# Altium project multi_power_amp_revision.PrjPcb
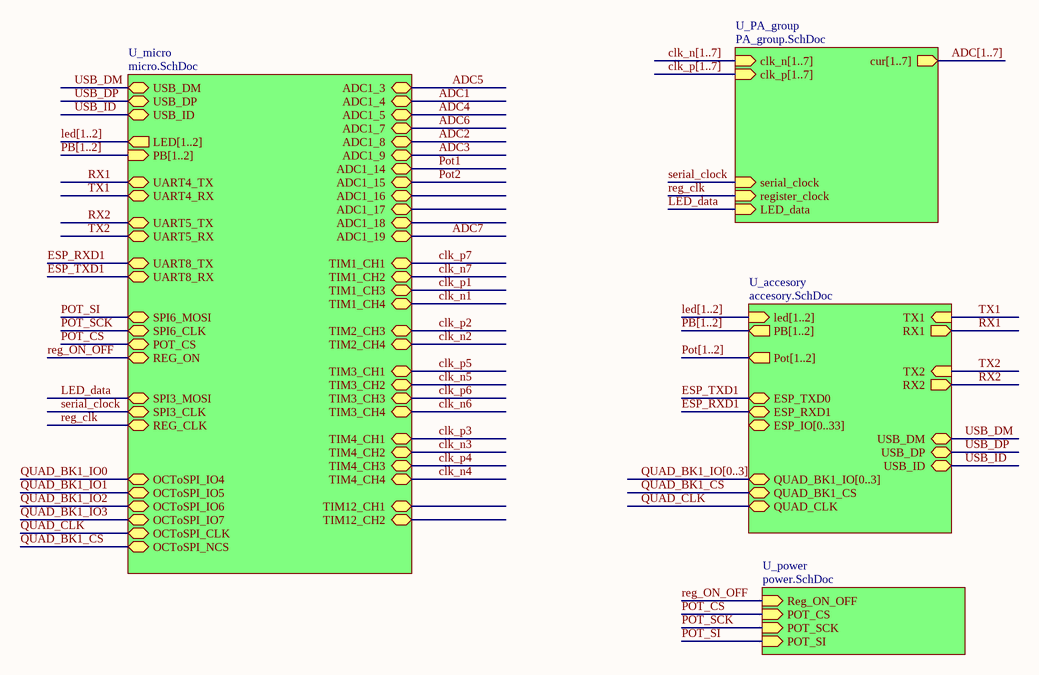
[diagram p0: top.SchDoc]
8 sheets, 322 parts. Net scope: hierarchical (ports join the sheet entries above them; power ports are global).
Board file: PowerAMP_revision.PcbDoc
Sheets:
  top.SchDoc
    U_micro = micro.SchDoc
    U_accesory = accesory.SchDoc
    U_PA_group = PA_group.SchDoc
      PA1 = PA_classD.SchDoc
        L = led_PA.SchDoc
      PA2 = PA_classD.SchDoc
        L = led_PA.SchDoc
      PA3 = PA_classD.SchDoc
        L = led_PA.SchDoc
      PA4 = PA_classD.SchDoc
        L = led_PA.SchDoc
      PA5 = PA_classD.SchDoc
        L = led_PA.SchDoc
      PA6 = PA_classD.SchDoc
        L = led_PA.SchDoc
      PA7 = PA_classD.SchDoc
        L = led_PA.SchDoc
      Rect = rectifiers.SchDoc
    U_power = power.SchDoc

## Sheet top.SchDoc
size A4

### Sub-sheets
U_accesory = accesory.SchDoc: led[1..2] (in), PB[1..2] (out), Pot[1..2] (out), RX1 (out), RX2 (out), TX1 (in), TX2 (in), USB_DM (bidir), USB_DP (bidir), USB_ID (bidir), ESP_TXD0 (bidir), ESP_RXD1 (bidir), ESP_IO[0..33] (bidir), QUAD_BK1_IO[0..3] (bidir), QUAD_BK1_CS (bidir), QUAD_CLK (bidir)
U_micro = micro.SchDoc: USB_DM (bidir), USB_DP (bidir), LED[1..2] (out), PB[1..2] (in), UART5_RX (bidir), ADC1_19 (bidir), REG_CLK (bidir), SPI6_MOSI (bidir), UART8_TX (bidir), SPI3_MOSI (bidir), ADC1_4 (bidir), UART4_TX (bidir), ADC1_7 (bidir), UART5_TX (bidir), ADC1_3 (bidir), ADC1_8 (bidir), ADC1_9 (bidir), UART8_RX (bidir), ADC1_5 (bidir), REG_ON (bidir), SPI3_CLK (bidir), SPI6_CLK (bidir), UART4_RX (bidir), ADC1_16 (bidir), TIM1_CH3 (bidir), TIM1_CH4 (bidir), TIM3_CH2 (bidir), TIM4_CH1 (bidir), TIM2_CH4 (bidir), ADC1_18 (bidir), TIM1_CH2 (bidir), ADC1_14 (bidir), TIM3_CH4 (bidir), TIM3_CH3 (bidir), ADC1_17 (bidir), TIM3_CH1 (bidir), TIM4_CH3 (bidir), USB_ID (bidir), TIM4_CH2 (bidir), ADC1_15 (bidir), TIM2_CH3 (bidir), TIM12_CH2 (bidir), TIM1_CH1 (bidir), TIM12_CH1 (bidir), TIM4_CH4 (bidir), POT_CS (bidir), OCToSPI_IO4 (bidir), OCToSPI_IO5 (bidir), OCToSPI_CLK (bidir), OCToSPI_IO7 (bidir), OCToSPI_NCS (bidir), OCToSPI_IO6 (bidir)
U_PA_group = PA_group.SchDoc: serial_clock (in), register_clock (in), LED_data (in), clk_n[1..7] (in), clk_p[1..7] (in), cur[1..7] (out)
U_power = power.SchDoc: Reg_ON_OFF (in), POT_CS (in), POT_SCK (in), POT_SI (in)

### Nets
ESP_RXD1: sheet U_micro/UART8_TX, sheet U_accesory/ESP_RXD1  [project net ESP_RXD0]
ESP_TXD1: sheet U_micro/UART8_RX, sheet U_accesory/ESP_TXD0  [project net ESP_TXD0]
LED_data: sheet U_micro/SPI3_MOSI, sheet U_PA_group/LED_data
POT_CS: sheet U_micro/POT_CS, sheet U_power/POT_CS
POT_SCK: sheet U_micro/SPI6_CLK, sheet U_power/POT_SCK
POT_SI: sheet U_micro/SPI6_MOSI, sheet U_power/POT_SI
QUAD_BK1_CS: sheet U_micro/OCToSPI_NCS, sheet U_accesory/QUAD_BK1_CS
QUAD_CLK: sheet U_micro/OCToSPI_CLK, sheet U_accesory/QUAD_CLK
reg_clk: sheet U_micro/REG_CLK, sheet U_PA_group/register_clock
reg_ON_OFF: sheet U_micro/REG_ON, sheet U_power/Reg_ON_OFF
RX1: sheet U_micro/UART4_TX, sheet U_accesory/RX1
RX2: sheet U_micro/UART5_TX, sheet U_accesory/RX2
serial_clock: sheet U_micro/SPI3_CLK, sheet U_PA_group/serial_clock
TX1: sheet U_micro/UART4_RX, sheet U_accesory/TX1
TX2: sheet U_micro/UART5_RX, sheet U_accesory/TX2
USB_DM: sheet U_micro/USB_DM, sheet U_accesory/USB_DM
USB_DP: sheet U_micro/USB_DP, sheet U_accesory/USB_DP
USB_ID: sheet U_micro/USB_ID, sheet U_accesory/USB_ID

### Buses and harness runs
bus ADC[1..7] = sheet U_PA_group/cur[1..7]
bus clk_n[1..7] = sheet U_PA_group/clk_n[1..7]
bus clk_p[1..7] = sheet U_PA_group/clk_p[1..7]
bus led[1..2] = sheet U_accesory/led[1..2]
bus led[1..2] = sheet U_micro/LED[1..2]
bus PB[1..2] = sheet U_accesory/PB[1..2]
bus PB[1..2] = sheet U_micro/PB[1..2]
bus Pot[1..2] = sheet U_accesory/Pot[1..2]
bus QUAD_BK1_IO[0..3] = sheet U_accesory/QUAD_BK1_IO[0..3]

## Sheet micro.SchDoc
size A4
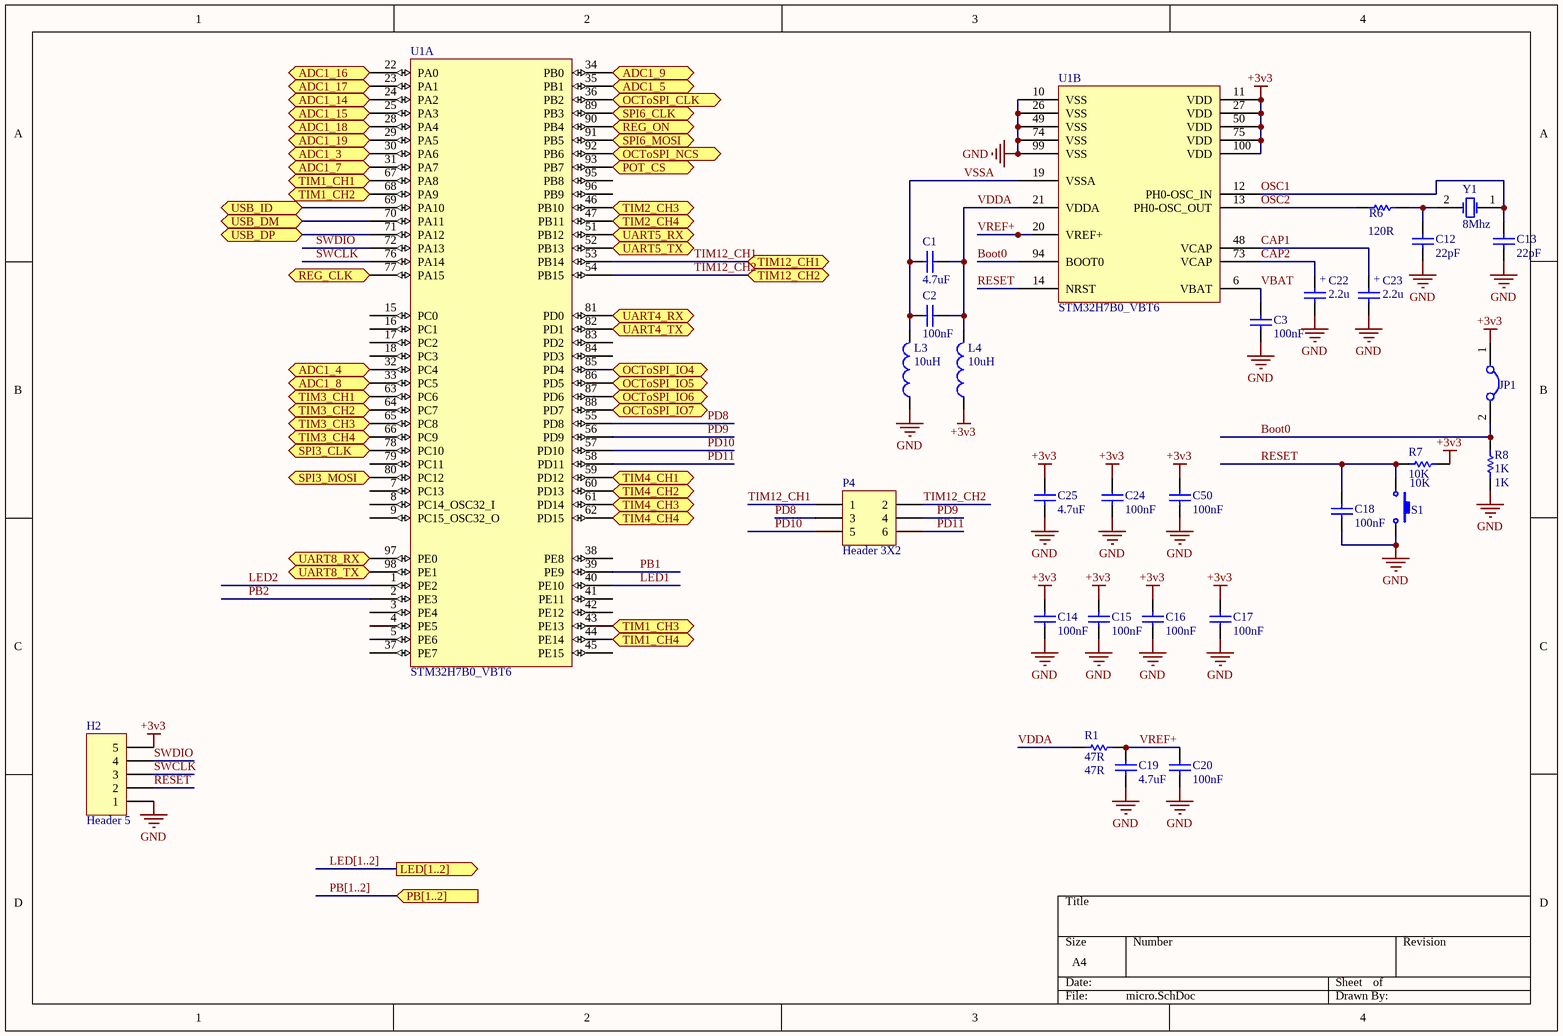
[diagram p1: micro.SchDoc]

### Parts
C1  4.7uF  [SMD_CAP_0805]
C2  100nF  [SMD_CAP_0805]
C3  100nF  [SMD_CAP_0805]
C12  22pF  [SMD_CAP_0805]
C13  22pF  [SMD_CAP_0805]
C14  100nF  [SMD_CAP_0805]
C15  100nF  [SMD_CAP_0805]
C16  100nF  [SMD_CAP_0805]
C17  100nF  [SMD_CAP_0805]
C18  100nF  [SMD_CAP_0805]
C19  4.7uF  [SMD_CAP_0805]
C20  100nF  [SMD_CAP_0805]
C22  value 2.2u  [SMD_CAP_0805]  (hidden comment: tantal size a)
C23  value 2.2u  [SMD_CAP_0805]  (hidden comment: tantal size a)
C24  100nF  [SMD_CAP_0805]
C25  4.7uF  [SMD_CAP_0805]
C50  100nF  [SMD_CAP_0805]
H2  Header 5  [HDR1X5]
JP1  Jumper  [Jumper Small - 2.54 - GRAY]  (value not drawn)
L3  value 10uH  [IND1206]  (hidden comment: inductor 10uH)
L4  value 10uH  [IND1206]  (hidden comment: inductor 10uH)
P4  Header 3X2  [HDR2X3]
R1  47R  [RES 0805 (2012X06L)]
R6  120R  [RES 0805 (2012X06L)]
R7  10K  [RES 0805 (2012X06L)]
R8  1K  [RES 0805 (2012X06L)]
S1  Switch PB  [Switch - Push to On]  (value not drawn)
U1  STM32H7B0_VBT6  [LQFP100_N]  (parts A,B of 2)
Y1  8Mhz  [CRYSTAL Small]

### Ports
ADC1_3 (bidir), ADC1_4 (bidir), ADC1_5 (bidir), ADC1_7 (bidir), ADC1_8 (bidir), ADC1_9 (bidir), ADC1_14 (bidir), ADC1_15 (bidir), ADC1_16 (bidir), ADC1_17 (bidir), ADC1_18 (bidir), ADC1_19 (bidir), LED[1..2] (out), OCToSPI_CLK (bidir), OCToSPI_IO4 (bidir), OCToSPI_IO5 (bidir), OCToSPI_IO6 (bidir), OCToSPI_IO7 (bidir), OCToSPI_NCS (bidir), PB[1..2] (in), POT_CS (bidir), REG_CLK (bidir), REG_ON (bidir), SPI3_CLK (bidir), SPI3_MOSI (bidir), SPI6_CLK (bidir), SPI6_MOSI (bidir), TIM1_CH1 (bidir), TIM1_CH2 (bidir), TIM1_CH3 (bidir), TIM1_CH4 (bidir), TIM2_CH3 (bidir), TIM2_CH4 (bidir), TIM3_CH1 (bidir), TIM3_CH2 (bidir), TIM3_CH3 (bidir), TIM3_CH4 (bidir), TIM4_CH1 (bidir), TIM4_CH2 (bidir), TIM4_CH3 (bidir), TIM4_CH4 (bidir), TIM12_CH1 (bidir), TIM12_CH2 (bidir), UART4_RX (bidir), UART4_TX (bidir), UART5_RX (bidir), UART5_TX (bidir), UART8_RX (bidir), UART8_TX (bidir), USB_DM (bidir), USB_DP (bidir), USB_ID (bidir)

### Nets
+3v3: C14.2 C15.2 C16.2 C17.2 C24.2 C25.1 C50.1 H2.5 JP1.1 L4.1 R7.1 U1.11(VDD) U1.27(VDD) U1.50(VDD) U1.75(VDD) U1.100(VDD)
GND: C3.1 C12.1 C13.1 C14.1 C15.1 C16.1 C17.1 C18.1 C19.2 C20.1 C22.- C23.- C24.1 C25.2 C50.2 H2.1 L3.1 R8.1 S1.2 U1.10(VSS) U1.26(VSS) U1.49(VSS) U1.74(VSS) U1.99(VSS)
ADC1: U1.32(PC4) ; port ADC1_4
ADC2: U1.33(PC5) ; port ADC1_8
ADC3: U1.34(PB0) ; port ADC1_9
ADC4: U1.35(PB1) ; port ADC1_5
ADC5: U1.30(PA6) ; port ADC1_3
ADC6: U1.31(PA7) ; port ADC1_7
ADC7: U1.29(PA5) ; port ADC1_19
Boot0: JP1.2 R8.2 U1.94(BOOT0)
CAP1: C23.+ U1.48(VCAP)
CAP2: C22.+ U1.73(VCAP)
clk_n1: U1.44(PE14) ; port TIM1_CH4
clk_n2: U1.47(PB11) ; port TIM2_CH4
clk_n3: U1.60(PD13) ; port TIM4_CH2
clk_n4: U1.62(PD15) ; port TIM4_CH4
clk_n5: U1.64(PC7) ; port TIM3_CH2
clk_n6: U1.66(PC9) ; port TIM3_CH4
clk_n7: U1.68(PA9) ; port TIM1_CH2
clk_p1: U1.43(PE13) ; port TIM1_CH3
clk_p2: U1.46(PB10) ; port TIM2_CH3
clk_p3: U1.59(PD12) ; port TIM4_CH1
clk_p4: U1.61(PD14) ; port TIM4_CH3
clk_p5: U1.63(PC6) ; port TIM3_CH1
clk_p6: U1.65(PC8) ; port TIM3_CH3
clk_p7: U1.67(PA8) ; port TIM1_CH1
ESP_RXD0: U1.98(PE1) ; port UART8_TX
ESP_TXD0: U1.97(PE0) ; port UART8_RX
LED1: U1.40(PE10)
LED2: U1.1(PE2)
LED_data: U1.80(PC12) ; port SPI3_MOSI
OSC1: C13.2 U1.12(PH0-OSC_IN) Y1.1(OSC1)
OSC2: R6.1 U1.13(PH0-OSC_OUT)
PB1: U1.39(PE9)
PB2: U1.2(PE3)
PD8: P4.3 U1.55(PD8)
PD9: P4.4 U1.56(PD9)
PD10: P4.5 U1.57(PD10)
PD11: P4.6 U1.58(PD11)
Pot1: U1.24(PA2) ; port ADC1_14
Pot2: U1.25(PA3) ; port ADC1_15
POT_CS: U1.93(PB7) ; port POT_CS
POT_SCK: U1.89(PB3) ; port SPI6_CLK
POT_SI: U1.91(PB5) ; port SPI6_MOSI
QUAD_BK1_CS: U1.92(PB6) ; port OCToSPI_NCS
QUAD_BK1_IO0: U1.85(PD4) ; port OCToSPI_IO4
QUAD_BK1_IO1: U1.86(PD5) ; port OCToSPI_IO5
QUAD_BK1_IO2: U1.87(PD6) ; port OCToSPI_IO6
QUAD_BK1_IO3: U1.88(PD7) ; port OCToSPI_IO7
QUAD_CLK: U1.36(PB2) ; port OCToSPI_CLK
reg_clk: U1.77(PA15) ; port REG_CLK
reg_ON_OFF: U1.90(PB4) ; port REG_ON
RESET: C18.2 H2.2 R7.2 S1.1 U1.14(NRST)
RX1: U1.82(PD1) ; port UART4_TX
RX2: U1.52(PB13) ; port UART5_TX
serial_clock: U1.78(PC10) ; port SPI3_CLK
SWCLK: H2.3 U1.76(PA14)
SWDIO: H2.4 U1.72(PA13)
TIM12_CH1: P4.1 U1.53(PB14) ; port TIM12_CH1
TIM12_CH2: P4.2 U1.54(PB15) ; port TIM12_CH2
TX1: U1.81(PD0) ; port UART4_RX
TX2: U1.51(PB12) ; port UART5_RX
USB_DM: U1.70(PA11) ; port USB_DM
USB_DP: U1.71(PA12) ; port USB_DP
USB_ID: U1.69(PA10) ; port USB_ID
VBAT: C3.2 U1.6(VBAT)
VDDA: C1.2 C2.2 L4.2 R1.2 U1.21(VDDA)
VREF+: C19.1 C20.2 R1.1 U1.20(VREF+)
VSSA: C1.1 C2.1 L3.2 U1.19(VSSA)
NetC12_2: C12.2 R6.2 Y1.2(OSC2)
NetU1_22: U1.22(PA0) ; port ADC1_16
NetU1_23: U1.23(PA1) ; port ADC1_17
NetU1_28: U1.28(PA4) ; port ADC1_18

Not connected (* = marked no-connect by the designer): U1 3(PE4) 4(PE5) 5(PE6) 7(PC13) 8(PC14_OSC32_I) 9(PC15_OSC32_O) 15(PC0) 16(PC1) 17(PC2) 18(PC3) 37(PE7) 38(PE8) 41(PE11) 42(PE12) 45(PE15) 79(PC11) 83(PD2) 84(PD3) 95(PB8) 96(PB9)

### Buses and harness runs
bus LED[1..2] = port LED[1..2]
bus PB[1..2] = port PB[1..2]

### Library data of the parts
C1-C3 C19 C25 C50 = Cap
  C1 C19 C25: Value: 4.7uF
  C2 C3 C50: Value: 100nF
C12-C18 C20 C24 = Cap: Capacitor; Published: 8-Jun-2000; LatestRevisionDate: 17-Jul-2002; LatestRevisionNote: Re-released for DXP Platform.; PackageReference: RAD-0.3; Publisher: Altium Limited; PackageDescription: Radial Cap, Thru-Hole; 2 Leads; 0.3 in Pin Spacing
  C12 C13: Value: 22pF
  C14-C18 C20 C24: Value: 100nF
C22 C23 = Cap Pol: pin to pad: +>1 ->2
H2 = Header 5: Header, 5-Pin; LatestRevisionDate: 17-Jul-2002; LatestRevisionNote: Re-released for DXP Platform.; Publisher: Altium Limited
JP1 = Jumper: Company: E.P.I.L; Defualt State: Close; Design Date: 2011/11/02
L3 L4 = Inductor: Code_IEC: 1005; Published: 8-Jun-2000; LatestRevisionDate: 29-May-2009; LatestRevisionNote: IPC-7351 Footprint Added.; PackageReference: 0402-A; Publisher: Altium Limited; PackageDescription: Chip Inductor; Code_JEITA: 0402
P4 = Header 3X2: Header, 3-Pin, Dual row; LatestRevisionDate: 17-Jul-2002; LatestRevisionNote: Re-released for DXP Platform.; Publisher: Altium Limited
R1 R6-R8 = Res1: Resistor; Published: 8-Jun-2000; LatestRevisionDate: 17-Jul-2002; LatestRevisionNote: Re-released for DXP Platform.; PackageReference: AXIAL-0.3; Publisher: Altium Limited; PackageDescription: Axial Device, Thru-Hole; 2 Leads; 0.3 in Pin Spacing
  R1: Value: 47R
  R6: Value: 120R
  R7: Value: 10K
  R8: Value: 1K
S1 = Switch PB: Push Button Switch
U1 = STM32H7B0_VBT6: STM32H7B0_VBT6 LQPF100
Y1 = XTAL: Crystal Oscillator; Published: 8-Jun-2000; LatestRevisionDate: 17-Jul-2002; LatestRevisionNote: Re-released for DXP Platform.; PackageReference: R38; Publisher: Altium Limited; PackageDescription: Crystal, Thru-Hole; 2 Leads; Body 3.1 x 8.2 mm (Dia.xH)

## Sheet accesory.SchDoc
size A4; SPICEModelCacheWUDVNOOA: <root> / <DocumentId>WUDVNOOA</DocumentId> / </root>
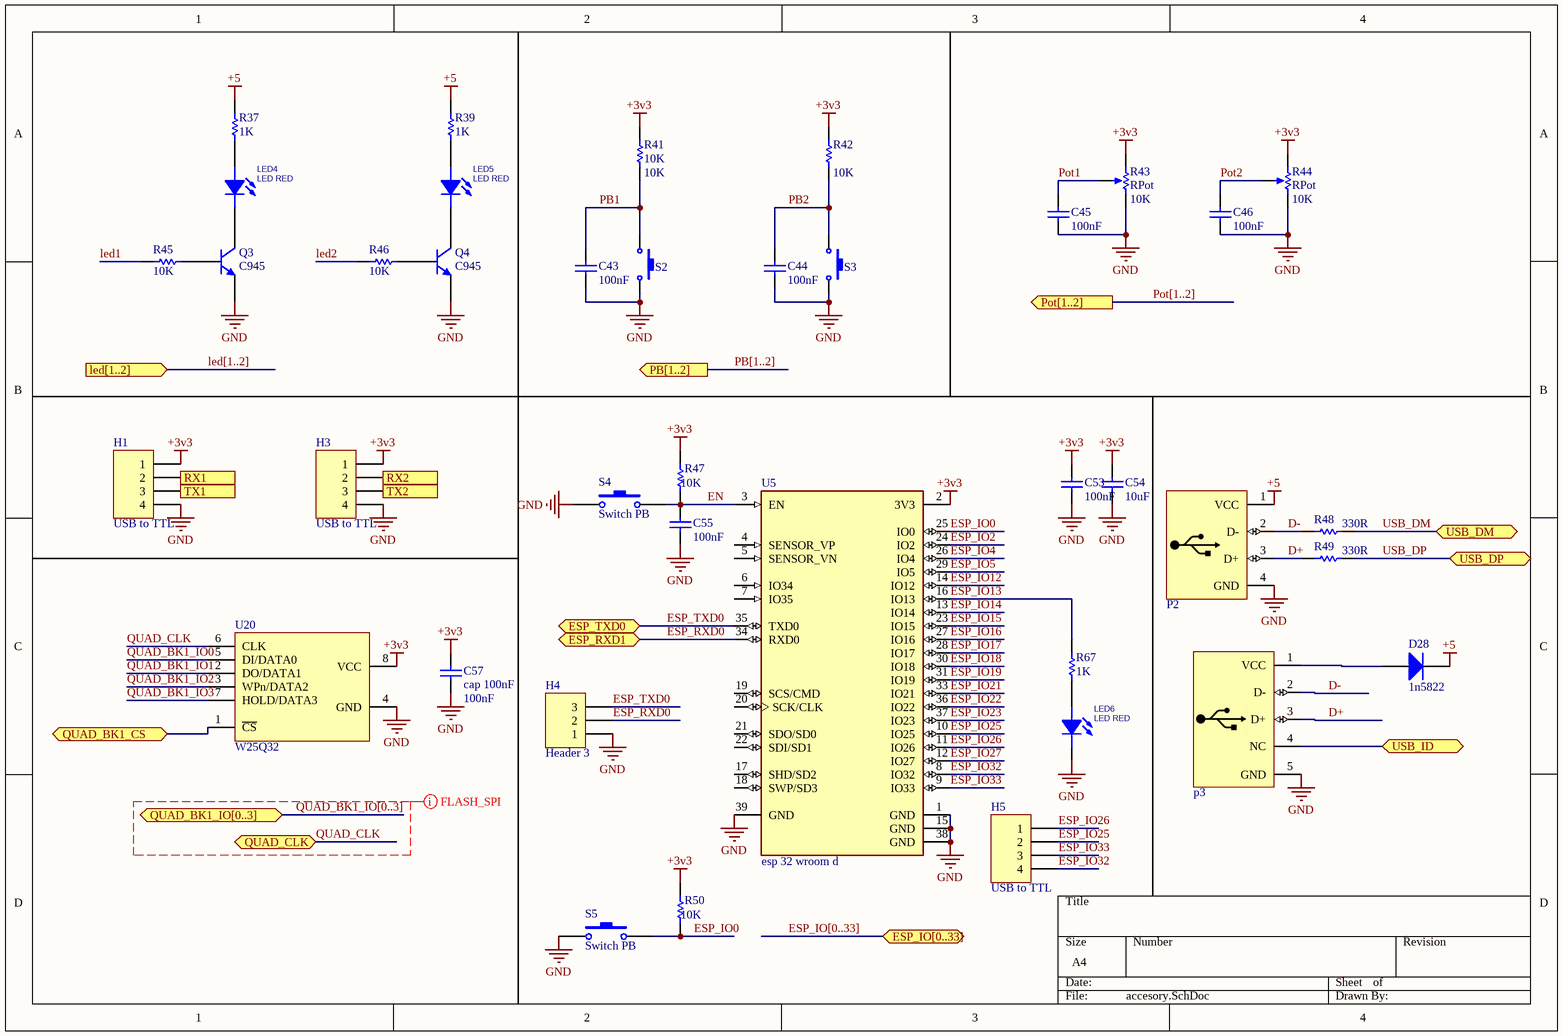
[diagram p2: accesory.SchDoc]

### Parts
C43  100nF  [SMD_CAP_0805]
C44  100nF  [SMD_CAP_0805]
C45  100nF  [SMD_CAP_0805]
C46  100nF  [SMD_CAP_0805]
C53  100nF  [CAP0805]
C54  10uF  [CAP0805]
C55  100nF  [CAP0805]
C57  cap 100nF  value 100nF  [Cap 805]
D28  1n5822  [DO214AC SMA]
H1  USB to TTL  [HDR1X4]
H3  USB to TTL  [HDR1X4]
H4  Header 3  [HDR1X3]
H5  USB to TTL  [HDR1X4]
LED4  LED RED  [led_0805]
LED5  LED RED  [led_0805]
LED6  LED RED  [led_0805]
P2  USB Connector  [USB2.5-2H4C]  (value not drawn)
p3  USB Connector  [USB_AB_BM_SHS]  (value not drawn)
Q3  C945  [SOT23_N]
Q4  C945  [SOT23_N]
R37  1K  [RES 0805 (2012X06L)]
R39  1K  [RES 0805 (2012X06L)]
R41  10K  [RES 0805 (2012X06L)]
R42  10K  [RES 0805 (2012X06L)]
R43  RPot  value 10K  [Multi Turn 02]
R44  RPot  value 10K  [Multi Turn 02]
R45  10K  [RES 0805 (2012X06L)]
R46  10K  [RES 0805 (2012X06L)]
R47  10K  [RES0805]
R48  330R  [RES 0805 (2012X06L)]
R49  330R  [RES 0805 (2012X06L)]
R50  10K  [RES0805]
R67  1K  [RES 0805 (2012X06L)]
S2  Switch PB  [Switch - Push to On]  (value not drawn)
S3  Switch PB  [Switch - Push to On]  (value not drawn)
S4  Switch PB  [Switch - Push to On]
S5  Switch PB  [Switch - Push to On]
U5  esp 32 wroom d  [esp-wroom]
U20  W25Q32  [WSON-8x6]

### Ports
ESP_IO[0..33] (bidir), ESP_RXD1 (bidir), ESP_TXD0 (bidir), led[1..2] (in), PB[1..2] (out), Pot[1..2] (out), QUAD_BK1_CS (bidir), QUAD_BK1_IO[0..3] (bidir), QUAD_CLK (bidir), RX1 (out), RX2 (out), TX1 (in), TX2 (in), USB_DM (bidir), USB_DP (bidir), USB_ID (bidir)

### Nets
+3v3: C53.2 C54.2 C57.2 H1.1 H3.1 R41.1 R42.1 R43.1(TOP) R44.1(TOP) R47.1 R50.1 U5.2(3V3) U20.8(VCC)
+5: D28.2(K) P2.1(VCC) R37.2 R39.2
GND: C43.1 C44.1 C45.1 C46.1 C53.1 C54.1 C55.1 C57.1 H1.4 H3.4 H4.1 LED6.2(CATHODE) P2.4(GND) p3.5(GND) Q3.2(E) Q4.2(E) R43.2(BOT) R44.2(BOT) S2.2 S3.2 S4.1 S5.1 U5.1(GND) U5.15(GND) U5.38(GND) U5.39(GND) U20.4(GND)
D+: P2.3(D+) p3.3(D+) R49.1
D-: P2.2(D-) p3.2(D-) R48.1
EN: C55.2 R47.2 S4.2 U5.3(EN)
ESP_IO0: R50.2 S5.2 U5.25(IO0)
ESP_IO2: U5.24(IO2)
ESP_IO4: U5.26(IO4)
ESP_IO5: U5.29(IO5)
ESP_IO12: U5.14(IO12)
ESP_IO13: R67.2 U5.16(IO13)
ESP_IO14: U5.13(IO14)
ESP_IO15: U5.23(IO15)
ESP_IO16: U5.27(IO16)
ESP_IO17: U5.28(IO17)
ESP_IO18: U5.30(IO18)
ESP_IO19: U5.31(IO19)
ESP_IO21: U5.33(IO21)
ESP_IO22: U5.36(IO22)
ESP_IO23: U5.37(IO23)
ESP_IO25: H5.2 U5.10(IO25)
ESP_IO26: H5.1 U5.11(IO26)
ESP_IO27: U5.12(IO27)
ESP_IO32: H5.4 U5.8(IO32)
ESP_IO33: H5.3 U5.9(IO33)
ESP_RXD0: H4.2 U5.34(RXD0) ; port ESP_RXD1
ESP_TXD0: H4.3 U5.35(TXD0) ; port ESP_TXD0
LED1: R45.1
LED2: R46.1
PB1: C43.2 R41.2 S2.1
PB2: C44.2 R42.2 S3.1
Pot1: C45.2 R43.3(TAP)
Pot2: C46.2 R44.3(TAP)
QUAD_BK1_CS: U20.1(~{CS}) ; port QUAD_BK1_CS
QUAD_BK1_IO0: U20.5(DI/DATA0)
QUAD_BK1_IO1: U20.2(DO/DATA1)
QUAD_BK1_IO2: U20.3(WPn/DATA2)
QUAD_BK1_IO3: U20.7(HOLD/DATA3)
QUAD_CLK: U20.6(CLK) ; port QUAD_CLK
RX1: H1.2 ; port RX1
RX2: H3.2 ; port RX2
TX1: H1.3 ; port TX1
TX2: H3.3 ; port TX2
USB_DM: R48.2 ; port USB_DM
USB_DP: R49.2 ; port USB_DP
USB_ID: p3.4(NC) ; port USB_ID
NetD28_1: D28.1(A) p3.1(VCC)
NetLED4_1: LED4.1(ANODE) R37.1
NetLED4_2: LED4.2(CATHODE) Q3.3(C)
NetLED5_1: LED5.1(ANODE) R39.1
NetLED5_2: LED5.2(CATHODE) Q4.3(C)
NetLED6_1: LED6.1(ANODE) R67.1
NetQ3_1: Q3.1(B) R45.2
NetQ4_1: Q4.1(B) R46.2

Not connected (* = marked no-connect by the designer): U5 4(SENSOR_VP) 5(SENSOR_VN) 6(IO34) 7(IO35) 17(SHD/SD2) 18(SWP/SD3) 19(SCS/CMD) 20(SCK/CLK) 21(SDO/SD0) 22(SDI/SD1)

### Buses and harness runs
bus ESP_IO[0..33] = port ESP_IO[0..33]
bus led[1..2] = port led[1..2]
bus PB[1..2] = port PB[1..2]
bus Pot[1..2] = port Pot[1..2]
bus QUAD_BK1_IO[0..3] = port QUAD_BK1_IO[0..3]

### Layout directives
net class FLASH_SPI: QUAD_BK1_IO[0..3], QUAD_CLK

### Library data of the parts
C43-C46 C57 = Cap: Capacitor; Published: 8-Jun-2000; LatestRevisionDate: 17-Jul-2002; LatestRevisionNote: Re-released for DXP Platform.; PackageReference: RAD-0.3; Publisher: Altium Limited; PackageDescription: Radial Cap, Thru-Hole; 2 Leads; 0.3 in Pin Spacing
  C43-C46: Value: 100nF
C53-C55 = Cap: CAP SMD 0805; Published: 8-Jun-2000; LatestRevisionDate: 17-Jul-2002; LatestRevisionNote: Re-released for DXP Platform.; PackageReference: RAD-0.3; Publisher: Altium Limited; PackageDescription: Radial Cap, Thru-Hole; 2 Leads; 0.3 in Pin Spacing
  C53 C55: Value: 100nF
  C54: Value: 10uF
D28 = Diode 1N4007: 1 Amp General Purpose Rectifier; Published: 8-Jun-2000; LatestRevisionDate: 17-Jul-2002; LatestRevisionNote: Re-released for DXP Platform.; DatasheetVersion: 1998; PackageVersion: Aug-1999; PackageReference: DO-41; Publisher: Altium Limited; PackageDescription: Diode, Axial; Body 5.2 x 2.7 mm (LxDia. max), Lead Dia. 0.86 mm (max); Code_JEDEC: DO-204-AL; ComponentLink1Description: Manufacturer Link; ComponentLink1URL: http://www.fairchildsemi.com/; ComponentLink2Description: Datasheet; ComponentLink2URL: http://www.fairchildsemi.com/ds/1N%2F1N4001.pdf
H1 H3 H5 = H-1x4
H4 = Header 3: Header, 3-Pin; LatestRevisionDate: 17-Jul-2002; LatestRevisionNote: Re-released for DXP Platform.; Publisher: Altium Limited
LED4-LED6 = LED 5MM: Light Emitting Diode; Designer: Abbas Basereh; Data: 16-12-2016; Link: *; Part.No: *
P2 = USB A-Type: USB Connector-A Type
p3 = USB MICRO: USB Connector MICRO-B Type; Designer: ABBAS BASEREH; Max Current: 1600mA; Mounting Technology: Surface Mount\Through-Hole; Category: Connector; Pin Count: 5-7; Publisher: ABBAS BASEREH; Status: Unreleased; ComponentLink1Description: Datasheet; ComponentLink2Description: Reference; Update: 1395-11-17
Q3 Q4 = C945: NPN Silicon Epitaxial Planar Transistor; Published: 2017-2-8; LatestRevisionDate: 2017; LatestRevisionNote: IPC-7351 Footprint Added.; DatasheetVersion: 2017; PackageVersion: 2017-2-8; PackageReference: SOT23; Publisher: Abbas Basereh; PackageDescription: 3-Pin SOT-23 Package 0.95 mm Pitch, 2.3 mm Lead Span; ComponentLink1Description: Manufacturer Link; ComponentLink1URL: http://www.taitroncomponents.com/; ComponentLink2Description: Datasheet; ComponentLink2URL: http://www.taitroncomponents.com/
R37 R39 R67 = RES Axial 0.25W: Designer: Abbas Basereh; Desc.: RES Axial 0.25W; Data: 4-1-2017
R41 R42 R45-R50 = Res1: Resistor; Published: 8-Jun-2000; LatestRevisionDate: 17-Jul-2002; LatestRevisionNote: Re-released for DXP Platform.; PackageReference: AXIAL-0.3; Publisher: Altium Limited; PackageDescription: Axial Device, Thru-Hole; 2 Leads; 0.3 in Pin Spacing
  R41 R42 R45-R47 R50: Value: 10K
  R48 R49: Value: 330R
R43 R44 = RPot: Potentiometer; Sim Note: Enter the Resistance value and the set point into parameter fields.; Set Position: 0.5; Published: 8-Jun-2000; LatestRevisionDate: 17-Jul-2002; LatestRevisionNote: Re-released for DXP Platform.; PackageReference: VR5; Publisher: Altium Limited; PackageDescription: Variable Resistor, Thru-Hole; 3 Leads
S2-S5 = Switch PB: Push Button Switch
U5 = ESP32-wroom
U20 = W25Q32: NOR flash

## Sheet PA_group.SchDoc
size A4
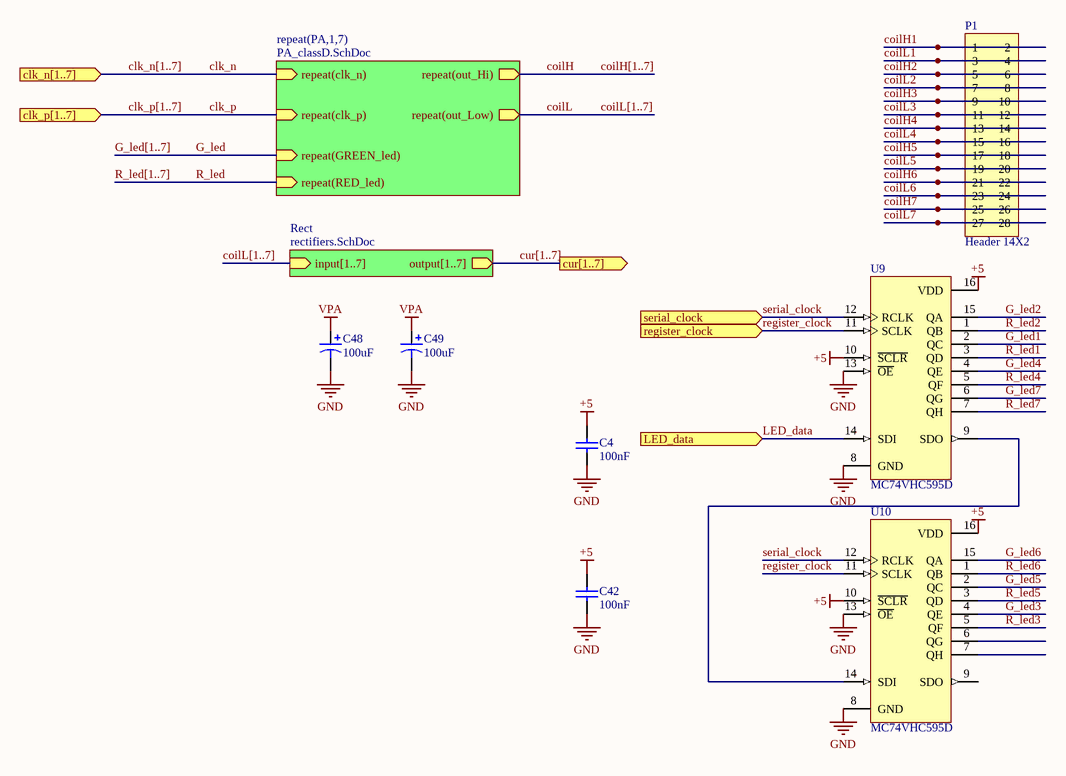
[diagram p3: PA_group.SchDoc]

### Parts
C4  100nF  [SMD_CAP_0805]
C42  100nF  [SMD_CAP_0805]
C48  value 100uF  [Cap SMD electrolite-6.3mm]
C49  value 100uF  [Cap SMD electrolite-6.3mm]
P1  Header 14X2  [HDR2X14]
U9  MC74VHC595D  [751B-05_N]
U10  MC74VHC595D  [751B-05_N]

### Sub-sheets
Rect = rectifiers.SchDoc: input[1..7] (in), output[1..7] (out)
repeat(PA,1,7) = PA_classD.SchDoc: repeat(clk_n) (in), repeat(clk_p) (in), repeat(out_Hi) (out), repeat(out_Low) (out), repeat(GREEN_led) (in), repeat(RED_led) (in)

### Ports
clk_n[1..7] (in), clk_p[1..7] (in), cur[1..7] (out), LED_data (in), register_clock (in), serial_clock (in)

### Nets
+5: C4.1 C42.1 U9.10(~{SCLR}) U9.16(VDD) U10.10(~{SCLR}) U10.16(VDD)
GND: C4.2 C42.2 C48.2 C49.2 U9.8(GND) U9.13(~{OE}) U10.8(GND) U10.13(~{OE})
VPA: C48.1 C49.1
clk_n: sheet repeat(PA,1,7)/repeat(clk_n)
clk_p: sheet repeat(PA,1,7)/repeat(clk_p)
coilH: sheet repeat(PA,1,7)/repeat(out_Hi)
coilH1: P1.1 P1.2
coilH2: P1.5 P1.6
coilH3: P1.9 P1.10
coilH4: P1.13 P1.14
coilH5: P1.17 P1.18
coilH6: P1.21 P1.22
coilH7: P1.25 P1.26
coilL: sheet repeat(PA,1,7)/repeat(out_Low)
coilL1: P1.3 P1.4
coilL2: P1.7 P1.8
coilL3: P1.11 P1.12
coilL4: P1.15 P1.16
coilL5: P1.19 P1.20
coilL6: P1.23 P1.24
coilL7: P1.27 P1.28
G_led: sheet repeat(PA,1,7)/repeat(GREEN_led)
G_led1: U9.2(QC)
G_led2: U9.15(QA)
G_led3: U10.4(QE)
G_led4: U9.4(QE)
G_led5: U10.2(QC)
G_led6: U10.15(QA)
G_led7: U9.6(QG)
LED_data: U9.14(SDI) ; port LED_data
R_led: sheet repeat(PA,1,7)/repeat(RED_led)
R_led1: U9.3(QD)
R_led2: U9.1(QB)
R_led3: U10.5(QF)
R_led4: U9.5(QF)
R_led5: U10.3(QD)
R_led6: U10.1(QB)
R_led7: U9.7(QH)
register_clock: U9.11(SCLK) U10.11(SCLK) ; port register_clock  [project net reg_clk]
serial_clock: U9.12(RCLK) U10.12(RCLK) ; port serial_clock
NetU9_9: U9.9(SDO) U10.14(SDI)

Not connected (* = marked no-connect by the designer): U10 6(QG) 7(QH) 9(SDO)

### Buses and harness runs
bus clk_n[1..7] = port clk_n[1..7]
bus clk_p[1..7] = port clk_p[1..7]
bus coilH[1..7]
bus coilL[1..7]
bus coilL[1..7] = sheet Rect/input[1..7]
bus cur[1..7] = port cur[1..7] = sheet Rect/output[1..7]
bus G_led[1..7]
bus R_led[1..7]

### Library data of the parts
C4 C42 = Cap ceramic: CAP-100Nf; Value: 100nF
C48 C49 = Cap Pol1: Polarized Capacitor (Radial); Published: 8-Jun-2000; LatestRevisionDate: 17-Jul-2002; LatestRevisionNote: Re-released for DXP Platform.; PackageReference: RB7.6-15; Publisher: Altium Limited; PackageDescription: Polarized Capacitor (Radial); 2 Leads
P1 = Header 14X2: Header, 14-Pin, Dual row; LatestRevisionDate: 17-Jul-2002; LatestRevisionNote: Re-released for DXP Platform.; Publisher: Altium Limited
U9 U10 = MC74VHC595D: 8-Bit 3-State Shift Register with Output Storage Register; ComponentAvailability: Not for New Design; Published: 15-Apr-2002; LatestRevisionDate: 13-Apr-2006; LatestRevisionNote: IPC-7351 Footprint Added.; DatasheetVersion: 1997; PackageVersion: Oct-1999; PackageReference: 751B-05; Publisher: Altium Limited; PackageDescription: 16-Pin Small Outline Integrated Circuit 1.27 mm Pitch; Code_JEDEC: MS-012-AC; Code_IPC: SOIC127P600-16; ComponentLink1Description: Manufacturer Link; ComponentLink1URL: http://www.onsemi.com/; ComponentLink2Description: Datasheet; ComponentLink2URL: http://www.onsemi.com/pub/Collateral/MC74VHC595-D.PDF

## Sheet PA_classD.SchDoc
size A4
Used 7 times, as channels U_PA_group/PA1, U_PA_group/PA2, U_PA_group/PA3, U_PA_group/PA4, U_PA_group/PA5, U_PA_group/PA6, U_PA_group/PA7. Parts and nets are listed once, with the designators drawn on the sheet.
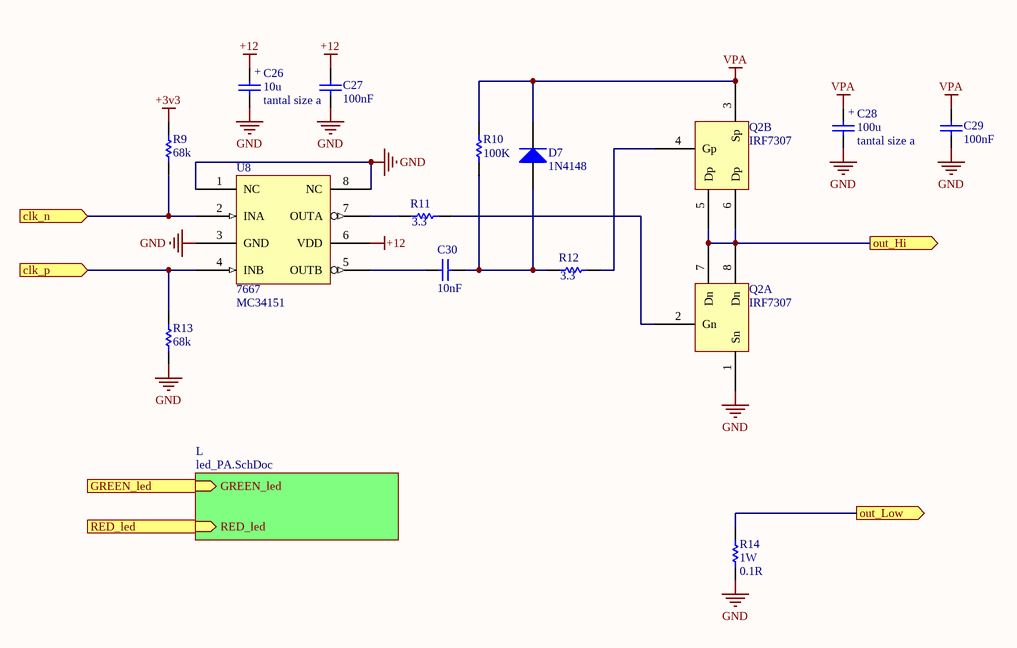
[diagram p4: PA_classD.SchDoc]

### Parts
C26  tantal size a  value 10u  [CAPP 1206 (3216X18L) Size A]
C27  100nF  [SMD_CAP_0805]
C28  tantal size a  value 100u  [CAPP 1206 (3216X18L) Size A]
C29  100nF  [SMD_CAP_0805]
C30  10nF  [SMD_CAP_0805]
D7  1N4148  [LL4148]
Q2  IRF7307  [SO8_M]  (parts A,B of 2)
R9  68k  [RES 0805 (2012X06L)]
R10  100K  [RES 0805 (2012X06L)]
R11  3.3  [RES 0805 (2012X06L)]
R12  3.3  [RES 0805 (2012X06L)]
R13  68k  [RES 0805 (2012X06L)]
R14  1W  value 0.1R  [Axial 1W  7_0mm]
U8  7667  [SO8_M]

### Sub-sheets
L = led_PA.SchDoc: GREEN_led (in), RED_led (in)

### Ports
clk_n (in), clk_p (in), GREEN_led (in), out_Hi (out), out_Low (out), RED_led (in)

### Nets
+3v3: R9.1
+12: C26.+ C27.1 U8.6(VDD)
GND: C26.- C27.2 C28.- C29.2 Q2.1(Sn) R13.2 R14.1 U8.1(NC) U8.3(GND) U8.8(NC)
VPA: C28.+ C29.1 D7.2(K) Q2.3(Sp) R10.1
clk_n: R9.2 U8.2(INA) ; port clk_n
clk_p: R13.1 U8.4(INB) ; port clk_p
GREEN_led: port GREEN_led, sheet L/GREEN_led
out_Hi: Q2.5(Dp) Q2.6(Dp) Q2.7(Dn) Q2.8(Dn) ; port out_Hi
out_Low: R14.2 ; port out_Low
RED_led: port RED_led, sheet L/RED_led
NetC30_1: C30.1 U8.5(OUTB)
NetC30_2: C30.2 D7.1(A) R10.2 R12.2
NetQ2_2: Q2.2(Gn) R11.1
NetQ2_4: Q2.4(Gp) R12.1
NetR11_2: R11.2 U8.7(OUTA)

### Channels
U_PA_group/PA1: designators end in _PA1; ports clk_n=clk_n1 clk_p=clk_p1 GREEN_led=G_led1 out_Hi=coilH1 out_Low=coilL1 RED_led=R_led1
U_PA_group/PA2: designators end in _PA2; ports clk_n=clk_n2 clk_p=clk_p2 GREEN_led=G_led2 out_Hi=coilH2 out_Low=coilL2 RED_led=R_led2
U_PA_group/PA3: designators end in _PA3; ports clk_n=clk_n3 clk_p=clk_p3 GREEN_led=G_led3 out_Hi=coilH3 out_Low=coilL3 RED_led=R_led3
U_PA_group/PA4: designators end in _PA4; ports clk_n=clk_n4 clk_p=clk_p4 GREEN_led=G_led4 out_Hi=coilH4 out_Low=coilL4 RED_led=R_led4
U_PA_group/PA5: designators end in _PA5; ports clk_n=clk_n5 clk_p=clk_p5 GREEN_led=G_led5 out_Hi=coilH5 out_Low=coilL5 RED_led=R_led5
U_PA_group/PA6: designators end in _PA6; ports clk_n=clk_n6 clk_p=clk_p6 GREEN_led=G_led6 out_Hi=coilH6 out_Low=coilL6 RED_led=R_led6
U_PA_group/PA7: designators end in _PA7; ports clk_n=clk_n7 clk_p=clk_p7 GREEN_led=G_led7 out_Hi=coilH7 out_Low=coilL7 RED_led=R_led7

### Notes on the sheet
- (near U8) MC34151

### Library data of the parts
C26 C28 = Cap Pol: pin to pad: +>1 ->2
C27 C29 C30 = Cap ceramic: CAP-100Nf
  C27 C29: Value: 100nF
  C30: Value: 10nF
D7 = Diode 1N4148: High Conductance Fast Diode; Published: 8-Jun-2000; LatestRevisionDate: 17-Jul-2002; LatestRevisionNote: Re-released for DXP Platform.; DatasheetVersion: 1997; PackageReference: DO-35; Publisher: Altium Limited; PackageDescription: Diode, Axial; Body 3.8 x 1.9 mm (LxDia. max), Lead Dia. 0.53 mm (max); Code_JEDEC: DO-204-AH; ComponentLink1Description: Manufacturer Link; ComponentLink1URL: http://www.fairchildsemi.com/; ComponentLink2Description: Datasheet; ComponentLink2URL: http://www.fairchildsemi.com/ds/1N%2F1N4148.pdf
Q2 = IRF7106
R9-R14 = Res1: Resistor; Published: 8-Jun-2000; LatestRevisionDate: 17-Jul-2002; LatestRevisionNote: Re-released for DXP Platform.; PackageReference: AXIAL-0.3; Publisher: Altium Limited; PackageDescription: Axial Device, Thru-Hole; 2 Leads; 0.3 in Pin Spacing
  R9 R13: Value: 68k
  R10: Value: 100K
  R11 R12: Value: 3.3
U8 = ICL7667

## Sheet led_PA.SchDoc
size A4
Used 7 times, as channels U_PA_group/PA1/L, U_PA_group/PA2/L, U_PA_group/PA3/L, U_PA_group/PA4/L, U_PA_group/PA5/L, U_PA_group/PA6/L, U_PA_group/PA7/L. Parts and nets are listed once, with the designators drawn on the sheet.
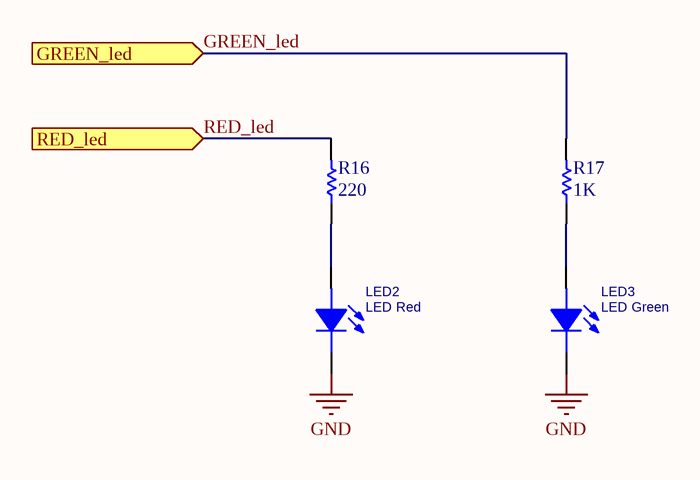
[diagram p5: led_PA.SchDoc]

### Parts
LED2  LED Red  [led_0805]
LED3  LED Green  [led_0805]
R16  220  [RES 0805 (2012X06L)]
R17  1K  [RES 0805 (2012X06L)]

### Ports
GREEN_led (in), RED_led (in)

### Nets
GND: LED2.2(CATHODE) LED3.2(CATHODE)
GREEN_led: R17.2 ; port GREEN_led
RED_led: R16.2 ; port RED_led
NetLED2_1: LED2.1(ANODE) R16.1
NetLED3_1: LED3.1(ANODE) R17.1

### Channels
U_PA_group/PA1/L: designators end in _U_PA_group_PA1_L; ports GREEN_led=G_led1 RED_led=R_led1
U_PA_group/PA2/L: designators end in _U_PA_group_PA2_L; ports GREEN_led=G_led2 RED_led=R_led2
U_PA_group/PA3/L: designators end in _U_PA_group_PA3_L; ports GREEN_led=G_led3 RED_led=R_led3
U_PA_group/PA4/L: designators end in _U_PA_group_PA4_L; ports GREEN_led=G_led4 RED_led=R_led4
U_PA_group/PA5/L: designators end in _U_PA_group_PA5_L; ports GREEN_led=G_led5 RED_led=R_led5
U_PA_group/PA6/L: designators end in _U_PA_group_PA6_L; ports GREEN_led=G_led6 RED_led=R_led6
U_PA_group/PA7/L: designators end in _U_PA_group_PA7_L; ports GREEN_led=G_led7 RED_led=R_led7

### Library data of the parts
LED2 LED3 = LED 5MM: as LED4 on sheet accesory; Data: 16-12-2016; Link: *; Part.No: *
R16 R17 = RES Axial 0.25W: Designer: Abbas Basereh; Desc.: RES Axial 0.25W; Data: 4-1-2017

## Sheet rectifiers.SchDoc
size A3; SPICEModelCacheBAFMZODH: <root> / <DocumentId>BAFMZODH</DocumentId> / <CacheFrame Number="0"> / <Model Name="tl084" Kind="CKT"> / <Text>*TL084 / *Quad JFETInput OpAmp pkg:DIP14 (A:3,2,4,11,1)(B:5,6,4,11,7)(C:10,9,4,11,8)(D:12,13,4,11,14) / * Connections: / *             Non-Inverting Input / *             | Inverting Input / *             | | Positive Power Supply / *             | | | Negative Power Supply / *             | | | | Output / *             | | | | | / .SUBCKT TL084 1 2 3 4 5 / C1   11 12 3.498E-12 / C2    6  7 15E-12 / DC    5 53 DX / DE   54  5 DX / DLP  90 91 DX / DLN  92 90 DX / DP    4  3 DX / BGND 99  0 V=V(3)*.5 + V(4)*.5 / BB    7 99 I=I(VB)*4.715E6 - I(VC)*5E6 + I(VE)*5E6 + / +              I(VLP)*5E6 - I(VLN)*5E6 / GA    6  0 11 12 282.8E-6 / GCM   0  6 10 99 8.942E-9 / ISS   3 10 DC 195E-6 / HLIM 90  0 VLIM 1K / J1   11  2 10 JX / J2   12  1 10 JX / R2    6  9 100E3 / RD1   4 11 3.536E3 / RD2   4 12 3.536E3 / RO1   8  5 150 / RO2   7 99 150 / RP    3  4 2.143E3 / RSS  10 99 1.026E6 / VB    9  0 DC 0 / VC    3 53 DC 2.2 / VE   54  4 DC 2.2 / VLIM  7  8 DC 0 / VLP  91  0 DC 25 / VLN   0 92 DC 25 / .MODEL DX D(IS=800E-18) / .MODEL JX PJF(IS=15E-12 BETA=270.1E-6 VTO=-1) / .ENDS TL084</Text> / </Model> / </CacheFrame> / </root>
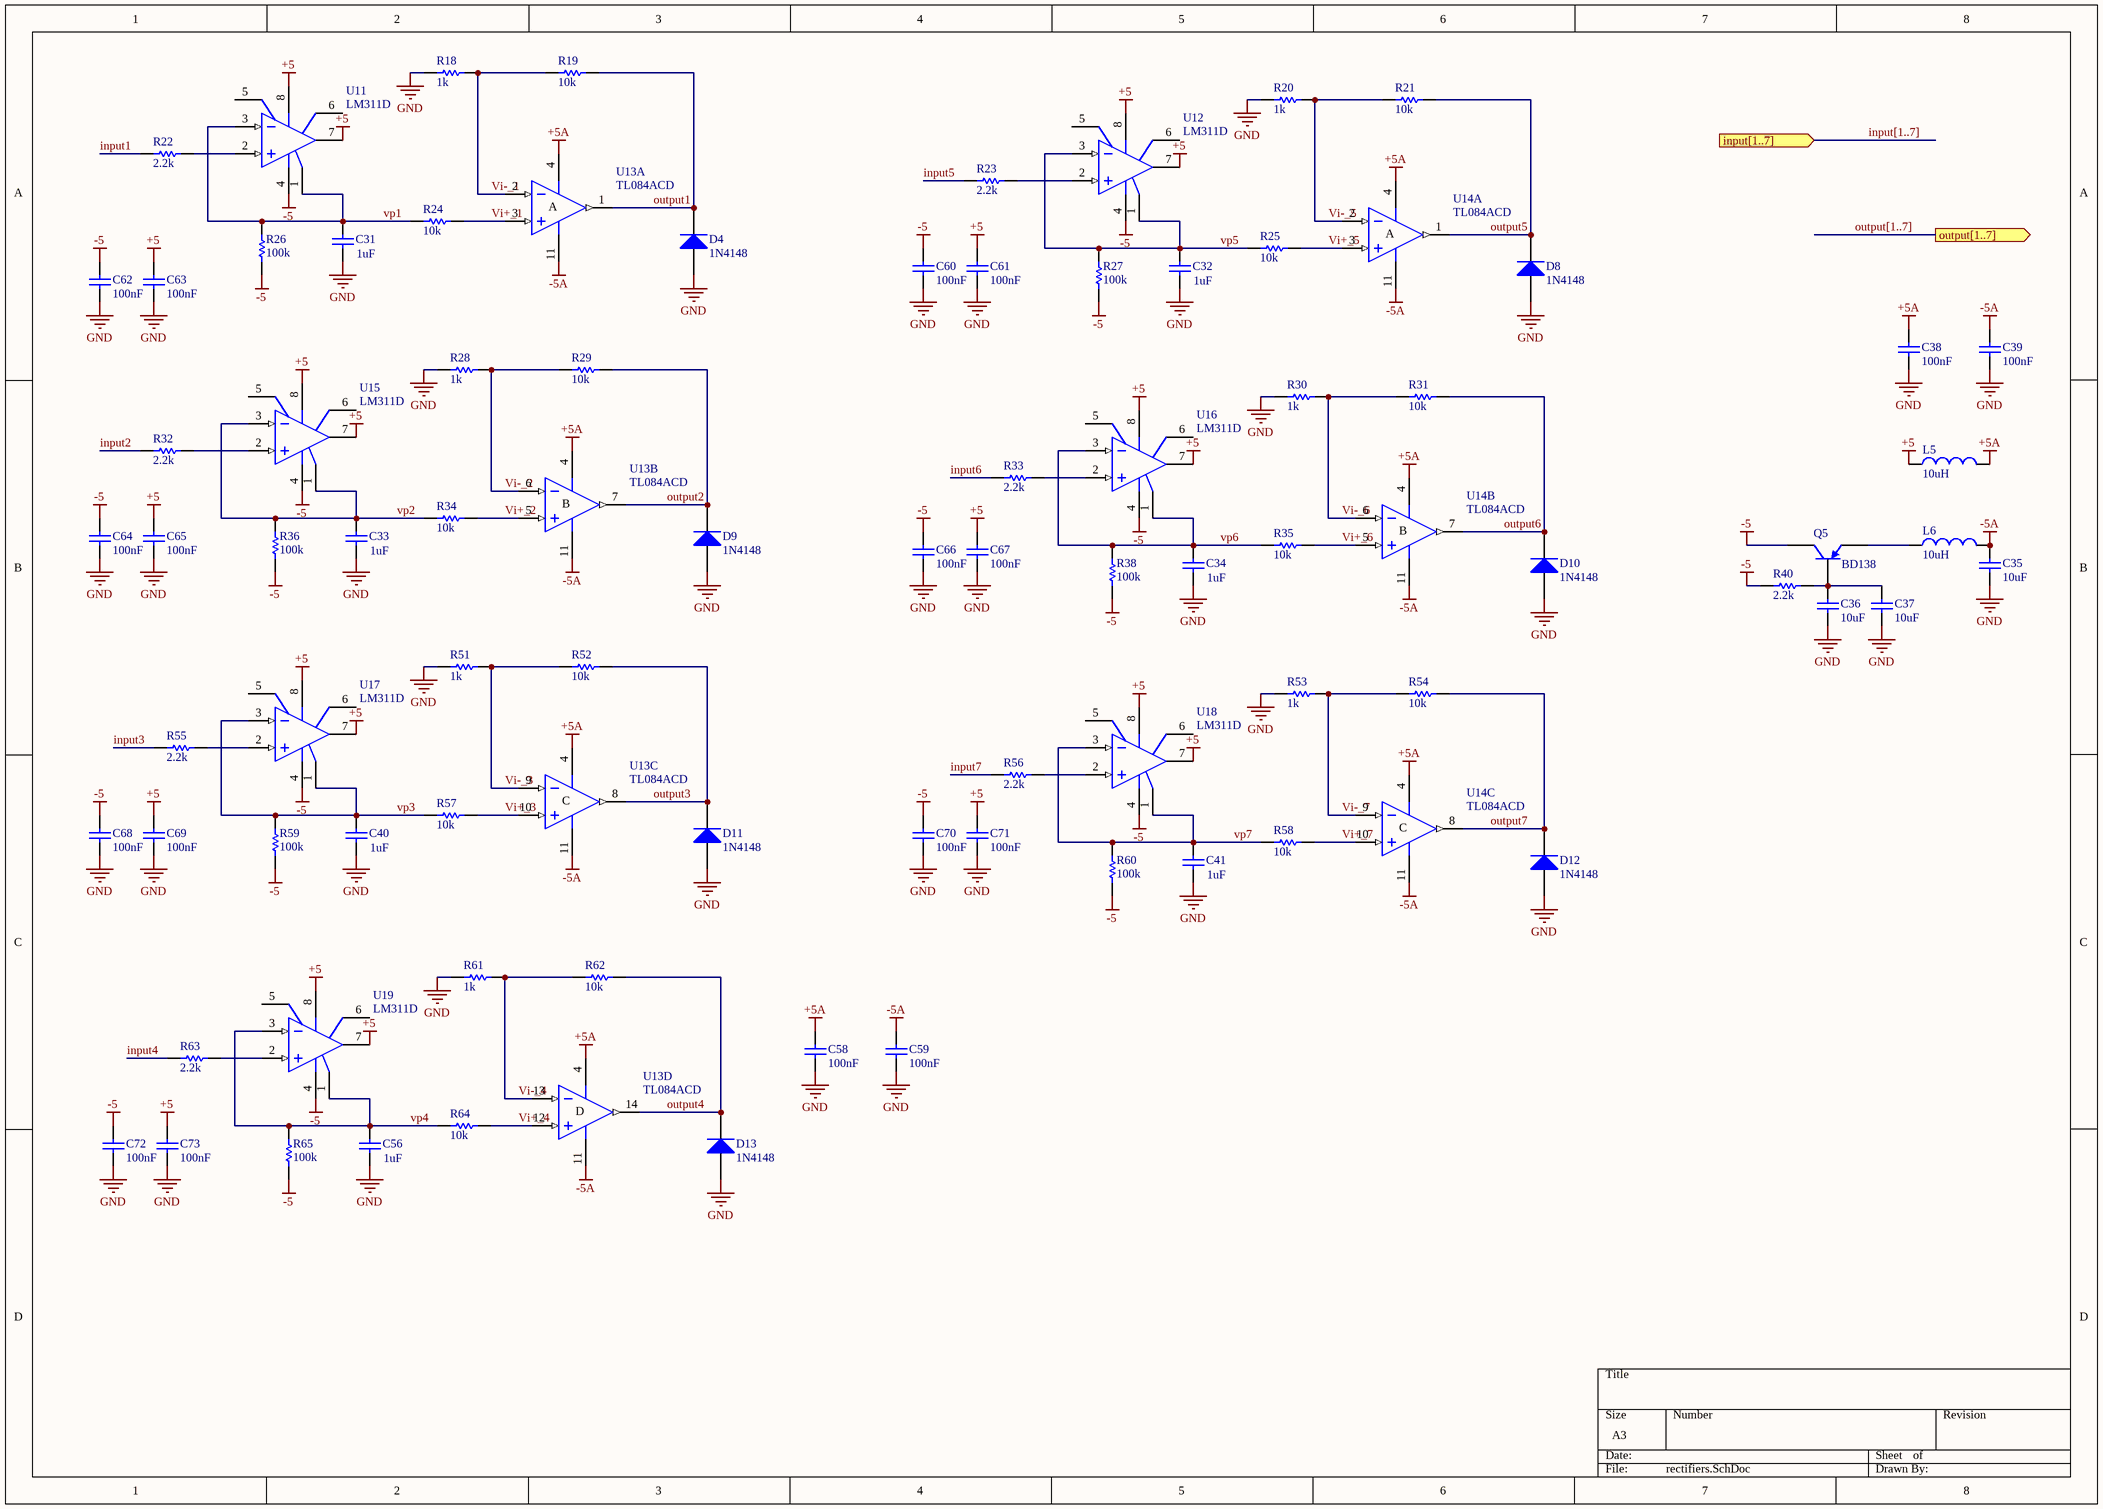
[diagram p6: rectifiers.SchDoc]

### Parts
C31  1uF  [SMD_CAP_0805]
C32  1uF  [SMD_CAP_0805]
C33  1uF  [SMD_CAP_0805]
C34  1uF  [SMD_CAP_0805]
C35  10uF  [SMD_CAP_0805]
C36  10uF  [SMD_CAP_0805]
C37  10uF  [SMD_CAP_0805]
C38  100nF  [SMD_CAP_0805]
C39  100nF  [SMD_CAP_0805]
C40  1uF  [SMD_CAP_0805]
C41  1uF  [SMD_CAP_0805]
C56  1uF  [SMD_CAP_0805]
C58  100nF  [SMD_CAP_0805]
C59  100nF  [SMD_CAP_0805]
C60  100nF  [SMD_CAP_0805]
C61  100nF  [SMD_CAP_0805]
C62  100nF  [SMD_CAP_0805]
C63  100nF  [SMD_CAP_0805]
C64  100nF  [SMD_CAP_0805]
C65  100nF  [SMD_CAP_0805]
C66  100nF  [SMD_CAP_0805]
C67  100nF  [SMD_CAP_0805]
C68  100nF  [SMD_CAP_0805]
C69  100nF  [SMD_CAP_0805]
C70  100nF  [SMD_CAP_0805]
C71  100nF  [SMD_CAP_0805]
C72  100nF  [SMD_CAP_0805]
C73  100nF  [SMD_CAP_0805]
D4  1N4148  [LL4148]
D8  1N4148  [LL4148]
D9  1N4148  [LL4148]
D10  1N4148  [LL4148]
D11  1N4148  [LL4148]
D12  1N4148  [LL4148]
D13  1N4148  [LL4148]
L5  value 10uH  [IND1206]  (hidden comment: inductor 10uH)
L6  value 10uH  [IND1206]  (hidden comment: inductor 10uH)
Q5  BD138  [SOT-32]
R18  1k  [RES 0805 (2012X06L)]
R19  10k  [RES 0805 (2012X06L)]
R20  1k  [RES 0805 (2012X06L)]
R21  10k  [RES 0805 (2012X06L)]
R22  2.2k  [RES 0805 (2012X06L)]
R23  2.2k  [RES 0805 (2012X06L)]
R24  10k  [RES 0805 (2012X06L)]
R25  10k  [RES 0805 (2012X06L)]
R26  100k  [RES 0805 (2012X06L)]
R27  100k  [RES 0805 (2012X06L)]
R28  1k  [RES 0805 (2012X06L)]
R29  10k  [RES 0805 (2012X06L)]
R30  1k  [RES 0805 (2012X06L)]
R31  10k  [RES 0805 (2012X06L)]
R32  2.2k  [RES 0805 (2012X06L)]
R33  2.2k  [RES 0805 (2012X06L)]
R34  10k  [RES 0805 (2012X06L)]
R35  10k  [RES 0805 (2012X06L)]
R36  100k  [RES 0805 (2012X06L)]
R38  100k  [RES 0805 (2012X06L)]
R40  2.2k  [RES 0805 (2012X06L)]
R51  1k  [RES 0805 (2012X06L)]
R52  10k  [RES 0805 (2012X06L)]
R53  1k  [RES 0805 (2012X06L)]
R54  10k  [RES 0805 (2012X06L)]
R55  2.2k  [RES 0805 (2012X06L)]
R56  2.2k  [RES 0805 (2012X06L)]
R57  10k  [RES 0805 (2012X06L)]
R58  10k  [RES 0805 (2012X06L)]
R59  100k  [RES 0805 (2012X06L)]
R60  100k  [RES 0805 (2012X06L)]
R61  1k  [RES 0805 (2012X06L)]
R62  10k  [RES 0805 (2012X06L)]
R63  2.2k  [RES 0805 (2012X06L)]
R64  10k  [RES 0805 (2012X06L)]
R65  100k  [RES 0805 (2012X06L)]
U11  LM311D  [SO8_N]
U12  LM311D  [SO8_N]
U13  TL084ACD  [SO14_N]  (parts A,B,C,D of 4)
U14  TL084ACD  [SO14_N]  (parts A,B,C of 4)
U15  LM311D  [SO8_N]
U16  LM311D  [SO8_N]
U17  LM311D  [SO8_N]
U18  LM311D  [SO8_N]
U19  LM311D  [SO8_N]

### Ports
input[1..7] (in), output[1..7] (out)

### Nets
+5: C61.2 C63.2 C65.2 C67.2 C69.2 C71.2 C73.2 L5.1 U11.7(OUT) U11.8(V+) U12.7(OUT) U12.8(V+) U15.7(OUT) U15.8(V+) U16.7(OUT) U16.8(V+) U17.7(OUT) U17.8(V+) U18.7(OUT) U18.8(V+) U19.7(OUT) U19.8(V+)
+5A: C38.2 C58.2 L5.2 U13.4(V+) U14.4(V+)
-5: C60.2 C62.2 C64.2 C66.2 C68.2 C70.2 C72.2 Q5.C R26.2 R27.2 R36.2 R38.2 R40.2 R59.2 R60.2 R65.2 U11.4(V-_(CASE)) U12.4(V-_(CASE)) U15.4(V-_(CASE)) U16.4(V-_(CASE)) U17.4(V-_(CASE)) U18.4(V-_(CASE)) U19.4(V-_(CASE))
-5A: C35.2 C39.2 C59.2 L6.2 U13.11(V-) U14.11(V-)
GND: C31.1 C32.1 C33.1 C34.1 C35.1 C36.1 C37.1 C38.1 C39.1 C40.1 C41.1 C56.1 C58.1 C59.1 C60.1 C61.1 C62.1 C63.1 C64.1 C65.1 C66.1 C67.1 C68.1 C69.1 C70.1 C71.1 C72.1 C73.1 D4.1(A) D8.1(A) D9.1(A) D10.1(A) D11.1(A) D12.1(A) D13.1(A) R18.2 R20.2 R28.2 R30.2 R51.2 R53.2 R61.2
input1: R22.2  [project net coilL1]
input2: R32.2  [project net coilL2]
input3: R55.2  [project net coilL3]
input4: R63.2  [project net coilL4]
input5: R23.2  [project net coilL5]
input6: R33.2  [project net coilL6]
input7: R56.2  [project net coilL7]
output1: D4.2(K) R19.1 U13.1(OUT)  [project net ADC1]
output2: D9.2(K) R29.1 U13.7(OUT)  [project net ADC2]
output3: D11.2(K) R52.1 U13.8(OUT)  [project net ADC3]
output4: D13.2(K) R62.1 U13.14(OUT)  [project net ADC4]
output5: D8.2(K) R21.1 U14.1(OUT)  [project net ADC5]
output6: D10.2(K) R31.1 U14.7(OUT)  [project net ADC6]
output7: D12.2(K) R54.1 U14.8(OUT)  [project net ADC7]
Vi+_1: R24.1 U13.3(IN+)
Vi+_2: R34.1 U13.5(IN+)
Vi+_3: R57.1 U13.10(IN+)
Vi+_4: R64.1 U13.12(IN+)
Vi+_5: R25.1 U14.3(IN+)
Vi+_6: R35.1 U14.5(IN+)
Vi+_7: R58.1 U14.10(IN+)
Vi-_1: R18.1 R19.2 U13.2(IN-)
Vi-_2: R28.1 R29.2 U13.6(IN-)
Vi-_3: R51.1 R52.2 U13.9(IN-)
Vi-_4: R61.1 R62.2 U13.13(IN-)
Vi-_5: R20.1 R21.2 U14.2(IN-)
Vi-_6: R30.1 R31.2 U14.6(IN-)
Vi-_7: R53.1 R54.2 U14.9(IN-)
vp1: C31.2 R24.2 R26.1 U11.1(GND) U11.3(IN-)
vp2: C33.2 R34.2 R36.1 U15.1(GND) U15.3(IN-)
vp3: C40.2 R57.2 R59.1 U17.1(GND) U17.3(IN-)
vp4: C56.2 R64.2 R65.1 U19.1(GND) U19.3(IN-)
vp5: C32.2 R25.2 R27.1 U12.1(GND) U12.3(IN-)
vp6: C34.2 R35.2 R38.1 U16.1(GND) U16.3(IN-)
vp7: C41.2 R58.2 R60.1 U18.1(GND) U18.3(IN-)
NetC36_2: C36.2 C37.2 Q5.B R40.1
NetL6_1: L6.1 Q5.E
NetR22_1: R22.1 U11.2(IN+)
NetR23_1: R23.1 U12.2(IN+)
NetR32_1: R32.1 U15.2(IN+)
NetR33_1: R33.1 U16.2(IN+)
NetR55_1: R55.1 U17.2(IN+)
NetR56_1: R56.1 U18.2(IN+)
NetR63_1: R63.1 U19.2(IN+)

Not connected (* = marked no-connect by the designer): U11 5(BAL) 6(BAL/STB); U12 5(BAL) 6(BAL/STB); U15 5(BAL) 6(BAL/STB); U16 5(BAL) 6(BAL/STB); U17 5(BAL) 6(BAL/STB); U18 5(BAL) 6(BAL/STB); U19 5(BAL) 6(BAL/STB)

### Buses and harness runs
bus input[1..7] = port input[1..7]
bus output[1..7] = port output[1..7]

### Notes on the sheet
- (in symbol TL084ACD, part A) A
- (in symbol TL084ACD, part B) B
- (in symbol TL084ACD, part C) C
- (in symbol TL084ACD, part D) D

### Library data of the parts
C31-C41 C56 C58-C73 = Cap ceramic: CAP-100Nf
  C31-C34 C40 C41 C56: Value: 1uF
  C35-C37: Value: 10uF
  C38 C39 C58-C73: Value: 100nF
D4 D8-D13 = Diode 1N4148: High Conductance Fast Diode; Published: 8-Jun-2000; LatestRevisionDate: 17-Jul-2002; LatestRevisionNote: Re-released for DXP Platform.; DatasheetVersion: 1997; PackageReference: DO-35; Publisher: Altium Limited; PackageDescription: Diode, Axial; Body 3.8 x 1.9 mm (LxDia. max), Lead Dia. 0.53 mm (max); Code_JEDEC: DO-204-AH; ComponentLink1Description: Manufacturer Link; ComponentLink1URL: http://www.fairchildsemi.com/; ComponentLink2Description: Datasheet; ComponentLink2URL: http://www.fairchildsemi.com/ds/1N%2F1N4148.pdf
L5 L6 = Inductor: Code_IEC: 1005; Published: 8-Jun-2000; LatestRevisionDate: 29-May-2009; LatestRevisionNote: IPC-7351 Footprint Added.; PackageReference: 0402-A; Publisher: Altium Limited; PackageDescription: Chip Inductor; Code_JEITA: 0402
Q5 = BD138: PNP Transistor; E-mail: picpars@gmail.com; De: Seyed Mohsen Ghasemian; web: www.picpars.com
R18-R36 R38 R40 R51-R65 = Res1: Resistor; Published: 8-Jun-2000; LatestRevisionDate: 17-Jul-2002; LatestRevisionNote: Re-released for DXP Platform.; PackageReference: AXIAL-0.3; Publisher: Altium Limited; PackageDescription: Axial Device, Thru-Hole; 2 Leads; 0.3 in Pin Spacing
  R18 R20 R28 R30 R51 R53 R61: Value: 1k
  R19 R21 R24 R25 R29 R31 R34 R35 R52 R54 R57 R58 R62 R64: Value: 10k
  R22 R23 R32 R33 R40 R55 R56 R63: Value: 2.2k
  R26 R27 R36 R38 R59 R60 R65: Value: 100k
U11 U12 U15-U19 = LM311D: Voltage Comparator; Published: 24-Aug-2001; LatestRevisionDate: 13-Apr-2006; LatestRevisionNote: IPC-7351 Footprint Added.; DatasheetVersion: Oct-1997; PackageVersion: Dec-2002; PackageReference: SO8; Publisher: Altium Limited; PackageDescription: 8-Pin Small Outline Integrated Circuit 1.27 mm Pitch; Code_JEDEC: MS-012-AA; Code_IPC: SOIC127P600-8; ComponentLink1Description: Manufacturer Link; ComponentLink1URL: http://www.st.com/; ComponentLink2Description: Datasheet; ComponentLink2URL: http://www.st.com/stonline/products/literature/ds/4848/lm211.pdf
U13 U14 = TL084ACD: General-Purpose J-FET Quad Operational Amplifier; Published: 24-Aug-2001; LatestRevisionDate: 13-Apr-2006; LatestRevisionNote: IPC-7351 Footprint Added.; DatasheetVersion: Jan-1999; PackageVersion: Sep-1998; PackageReference: SO14; Publisher: Altium Limited; PackageDescription: 14-Pin Small Outline Integrated Circuit 1.27 mm Pitch; Code_IPC: SOIC127P600-14; ComponentLink1Description: Manufacturer Link; ComponentLink1URL: http://www.st.com/; ComponentLink2Description: Datasheet; ComponentLink2URL: http://www.st.com/stonline/products/literature/ds/2301/tl084.pdf

## Sheet power.SchDoc
size A4; SPICEModelCacheCVNPFVZF: <root> / <DocumentId>CVNPFVZF</DocumentId> / <CacheFrame Number="0"> / <Model Name="cap" Kind="MDL"> / <Text>*Default semiconductor capacitor / .MODEL CAP C()</Text> / </Model> / <Model Name="zener" Kind="MDL"> / <Text>*ZENER / *Default Zener 10V @ 10mA / *Zener Diode Pinout: A,K / .MODEL ZENER D( BV=10 IBV=10E-3 )</Text> / </Model> / </CacheFrame> / </root>
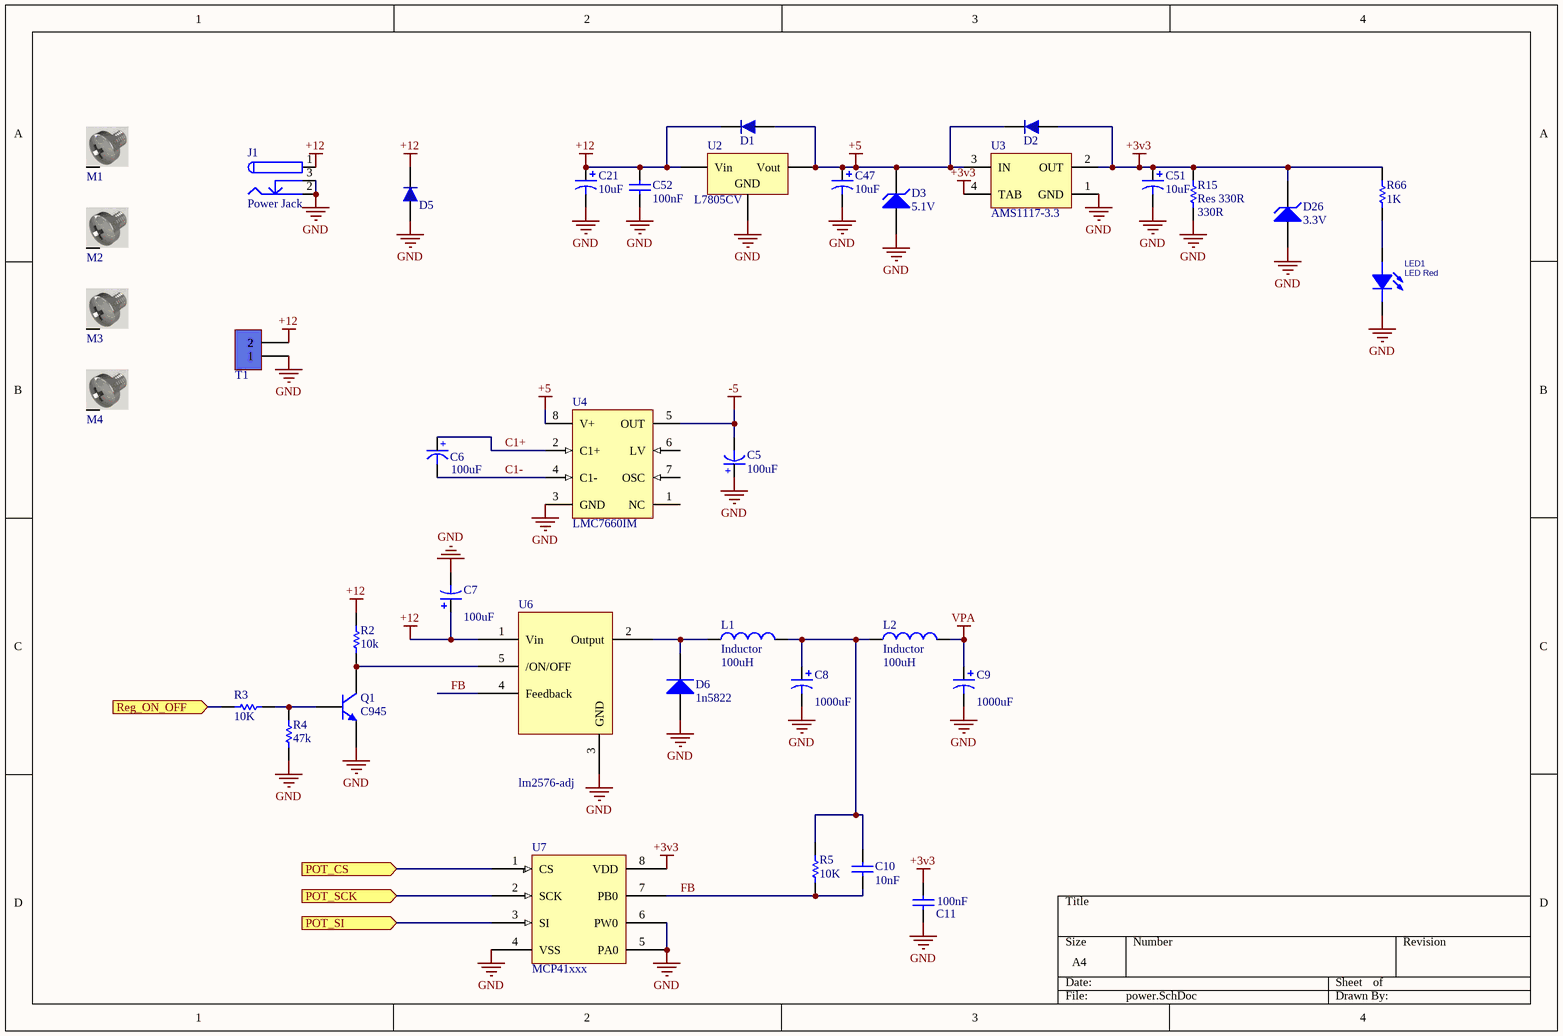
[diagram p7: power.SchDoc]

### Parts
C5  100uF  [Cap SMD electrolite-6.3mm]
C6  100uF  [Cap SMD electrolite-6.3mm]
C7  value 100uF  [Cap SMD electrolite-6.3mm]
C8  value 1000uF  [Cap SMD electrolite-10.3mm]
C9  value 1000uF  [Cap SMD electrolite-10.3mm]
C10  10nF  [SMD_CAP_0805]
C11  100nF  [SMD_CAP_0805]
C21  value 10uF  [CAP0805]  (hidden comment: cap 10uF)
C47  value 10uF  [CAP0805]  (hidden comment: cap 10uF)
C51  value 10uF  [CAP0805]  (hidden comment: cap 10uF)
C52  value 100nF  [CAP0805]  (hidden comment: cap 100nF)
D1  uf4007  [DIOM4629X24N]  (value not drawn)
D2  uf4007  [DIOM4629X24N]  (value not drawn)
D3  5.1V  [Diode 1n4148 SMD]
D5  uf4007  [DIOM4629X24N]  (value not drawn)
D6  1n5822  [DO214AC SMA]
D26  3.3V  [Diode 1n4148 SMD]
J1  Power Jack  [Power Jack]
L1  Inductor  value 100uH  [inductor]
L2  Inductor  value 100uH  [inductor]
LED1  LED Red  [led_0805]
M1  Screw  [Screw]  (value not drawn)
M2  Screw  [Screw]  (value not drawn)
M3  Screw  [Screw]  (value not drawn)
M4  Screw  [Screw]  (value not drawn)
Q1  C945  [SOT23_N]
R2  10k  [RES 0805 (2012X06L)]
R3  10K  [RES 0805 (2012X06L)]
R4  47k  [RES 0805 (2012X06L)]
R5  10K  [RES 0805 (2012X06L)]
R15  Res 330R  value 330R  [RES0805]
R66  1K  [RES 0805 (2012X06L)]
T1  Terminal  [Terminal 1*2_1]  (value not drawn)
U2  L7805CV  [REG-7805-smd]
U3  AMS1117-3.3  [SOT223]
U4  LMC7660IM  [M08A_N]
U6  lm2576-adj  [2596]
U7  MCP41xxx  [SO8_M]

### Ports
POT_CS (in), POT_SCK (in), POT_SI (in), Reg_ON_OFF (in)

### Nets
+3v3: C11.2 C51.1 D2.1 D26.2(K) R15.2 R66.2 U3.2(OUT) U3.4(TAB) U7.8(VDD)
+5: C47.1 D1.1 D2.2 D3.2(K) U2.3(Vout) U3.3(IN) U4.8(V+)
+12: C7.1 C21.1 C52.1 D1.2 D5.2 J1.1 R2.2 T1.2 U2.1(Vin) U6.1(Vin)
-5: C5.2(-) U4.5(OUT)
GND: C5.1(+) C7.2 C8.2 C9.2 C11.1 C21.2 C47.2 C51.2 C52.2 D3.1(A) D5.1 D6.1(A) D26.1(A) J1.2 J1.3 LED1.2(CATHODE) Q1.2(E) R4.1 R15.1 T1.1 U2.2(GND) U3.1(GND) U4.3(GND) U6.3(GND) U7.4(VSS) U7.5(PA0) U7.6(PW0)
VPA: C9.1 L2.2
C1+: C6.1(+) U4.2(C1+)
C1-: C6.2(-) U4.4(C1-)
FB: C10.2 R5.1 U6.4(Feedback) U7.7(PB0)
POT_CS: U7.1(CS) ; port POT_CS
POT_SCK: U7.2(SCK) ; port POT_SCK
POT_SI: U7.3(SI) ; port POT_SI
reg_ON_OFF: R3.1 ; port Reg_ON_OFF
NetC8_1: C8.1 C10.1 L1.2 L2.1 R5.2
NetD6_2: D6.2(K) L1.1 U6.2(Output)
NetLED1_1: LED1.1(ANODE) R66.1
NetQ1_1: Q1.1(B) R3.2 R4.2
NetQ1_3: Q1.3(C) R2.1 U6.5(/ON/OFF)

Not connected (* = marked no-connect by the designer): M1 S; M2 S; M3 S; M4 S; U4 1(NC) 6(LV) 7(OSC)

### Library data of the parts
C5 C6 = Cap-Polar: Polar Capacitor; Designer: Saeid Jorablo; Organazation: ControTec; Voltage: 16V; Adding Date: 1387/12/20; Value: 100uF
C7-C9 = Cap Pol1: Polarized Capacitor (Radial); Published: 8-Jun-2000; LatestRevisionDate: 17-Jul-2002; LatestRevisionNote: Re-released for DXP Platform.; PackageReference: RB7.6-15; Publisher: Altium Limited; PackageDescription: Polarized Capacitor (Radial); 2 Leads
C10 C11 = Cap ceramic: CAP-100Nf
  C10: Value: 10nF
  C11: Value: 100nF
C21 C47 C51 = Cap Pol1: CAP seramic; Published: 8-Jun-2000; LatestRevisionDate: 17-Jul-2002; LatestRevisionNote: Re-released for DXP Platform.; PackageReference: RB7.6-15; Publisher: Altium Limited; PackageDescription: Polarized Capacitor (Radial); 2 Leads
C52 = Cap ceramic: CAP seramic
D1 D2 D5 = 1n4007 SMD M7: Standard Rectifiers; Part. No: M7; Manufacturer: DC COMPONENTS; Designer: Abbas Basereh; Link: http://www.tme.eu/en/details/m7/smd-universal-diodes/dc-components/; Link: https://www.aliexpress.com/item/Smd-tube-1n4007-m7-SMA/1213719741.html?spm=2114.01010208.3.1.ZyZ7bC&ws_ab_test=searchweb0_0,searchweb201602_4_10065_10068_10084_10083_10080_10082_10081_10060_10061_10062_10056_10055_10054_10059_10099_10078_10079_427_10073_10103_10102_10096_10052_10050_10051,searchweb201603_4&btsid=db2be5ca-e560-400a-b91c-484ab5ee228b; Data: 16-12-2016
D3 D26 = D Zener: Zener Diode; Published: 8-Jun-2000; LatestRevisionDate: 17-Jul-2002; LatestRevisionNote: Re-released for DXP Platform.; PackageReference: DIODE-0.7; Publisher: Altium Limited; PackageDescription: Diode, Thru-Hole; 2 Leads; 0.7 in Pin Spacing
D6 = Diode 1N4007: 1 Amp General Purpose Rectifier; Published: 8-Jun-2000; LatestRevisionDate: 17-Jul-2002; LatestRevisionNote: Re-released for DXP Platform.; DatasheetVersion: 1998; PackageVersion: Aug-1999; PackageReference: DO-41; Publisher: Altium Limited; PackageDescription: Diode, Axial; Body 5.2 x 2.7 mm (LxDia. max), Lead Dia. 0.86 mm (max); Code_JEDEC: DO-204-AL; ComponentLink1Description: Manufacturer Link; ComponentLink1URL: http://www.fairchildsemi.com/; ComponentLink2Description: Datasheet; ComponentLink2URL: http://www.fairchildsemi.com/ds/1N%2F1N4001.pdf
J1 = Power Jack: Designer: Saeid Jorablo; Company: Personal; Project Name: Laser; Adding Date: 10/21/2009
L1 = Inductor: SMD Inductor; Code_IEC: 1005; Published: 8-Jun-2000; LatestRevisionDate: 29-May-2009; LatestRevisionNote: IPC-7351 Footprint Added.; PackageReference: 0402-A; Publisher: Altium Limited; PackageDescription: Chip Inductor; Code_JEITA: 0402
L2 = Inductor: Code_IEC: 1005; Published: 8-Jun-2000; LatestRevisionDate: 29-May-2009; LatestRevisionNote: IPC-7351 Footprint Added.; PackageReference: 0402-A; Publisher: Altium Limited; PackageDescription: Chip Inductor; Code_JEITA: 0402
LED1 = LED 5MM: as LED4 on sheet accesory; Data: 16-12-2016; Link: *; Part.No: *
M1-M4 = Board Screw: Board Screw With Spacer
Q1 = C945: NPN Silicon Epitaxial Planar Transistor; Published: 2017-2-8; LatestRevisionDate: 2017; LatestRevisionNote: IPC-7351 Footprint Added.; DatasheetVersion: 2017; PackageVersion: 2017-2-8; PackageReference: SOT23; Publisher: Abbas Basereh; PackageDescription: 3-Pin SOT-23 Package 0.95 mm Pitch, 2.3 mm Lead Span; ComponentLink1Description: Manufacturer Link; ComponentLink1URL: http://www.taitroncomponents.com/; ComponentLink2Description: Datasheet; ComponentLink2URL: http://www.taitroncomponents.com/
R2-R4 R15 = Res1: Resistor; Published: 8-Jun-2000; LatestRevisionDate: 17-Jul-2002; LatestRevisionNote: Re-released for DXP Platform.; PackageReference: AXIAL-0.3; Publisher: Altium Limited; PackageDescription: Axial Device, Thru-Hole; 2 Leads; 0.3 in Pin Spacing
  R2: Value: 10k
  R3: Value: 10K
  R4: Value: 47k
R5 R66 = RES Axial 0.25W: Designer: Abbas Basereh; Desc.: RES Axial 0.25W; Data: 4-1-2017
T1 = Terminal 1*2: Terminal 2 Pin 250VAC 16A; Designer: Seyed Mohsen Ghasemain; E-mail: picpars@gmail.com; ComponentLinkURL: www.picpars.com
U2 = L7805CV-Linear Voltage Regulator IC Positive 1 Output 5V 1.5A TO-220AB: Linear Voltage Regulator IC Positive FIXED; Manufacturer: STMicroelectronics; Designer: Abbas Basereh; Link: https://www.aliexpress.com/item/; Link: http://www.tme.eu/en/; Link: http://www.digikey.com/; Part. No: L7805CV
U3 = AMS1117-x.x: x.x Volt, 800mA Low-Dropout Linear Regulator, 4-pin SOT-223; Designer: Ali Hafizi; Data: 16-12-2016
U4 = LMC7660IM: Switched Capacitor Voltage Converter; Manufacturer: National Semiconductor; CompType: Switch Caps; PackageTopMarking: NSZXTT*LMC76*60IM; PowerWise: N; Published: 4-Dec-2008; DatasheetVersion: Feb-2005; PackageVersion: revL, Sep-2006; PackageReference: M08A; Publisher: Altium Limited; PackageDescription: SOIC Narrow, 4.9 x 3.9 x 1.45mm, 8 Lead, 1.27mm Pitch; PartNumber: LMC7660IM; RoHS: O; PinCount: 8; DigiKeyPartNumber: LMC7660IM-ND; Code_JEDEC: MS-012-AA; Code_IPC: SOIC127P600-8; ComponentLink1Description: LMC7660 Datasheet; ComponentLink1URL: http://www.national.com/ds/LM/LMC7660.pdf; ComponentLink2Description: LMC7660 Web Page; ComponentLink2URL: http://www.national.com/pf/LM/LMC7660.html; ComponentLink3Description: M08A Package Page; ComponentLink3URL: http://www.national.com/packaging/folders/m08a.html
U6 = lm2596

## Nets that join several sheets
+3v3: micro (16 pins), accesory (13 pins), U_PA_group/PA1 (R9_PA1.1), U_PA_group/PA2 (R9_PA2.1), U_PA_group/PA3 (R9_PA3.1), U_PA_group/PA4 (R9_PA4.1), U_PA_group/PA5 (R9_PA5.1), U_PA_group/PA6 (R9_PA6.1), U_PA_group/PA7 (R9_PA7.1), power (9 pins)
+5: accesory (D28.2 P2.1 R37.2 R39.2), PA_group (6 pins), rectifiers (22 pins), power (7 pins)
+12: U_PA_group/PA1 (C26_PA1.+ C27_PA1.1 U8_PA1.6), U_PA_group/PA2 (C26_PA2.+ C27_PA2.1 U8_PA2.6), U_PA_group/PA3 (C26_PA3.+ C27_PA3.1 U8_PA3.6), U_PA_group/PA4 (C26_PA4.+ C27_PA4.1 U8_PA4.6), U_PA_group/PA5 (C26_PA5.+ C27_PA5.1 U8_PA5.6), U_PA_group/PA6 (C26_PA6.+ C27_PA6.1 U8_PA6.6), U_PA_group/PA7 (C26_PA7.+ C27_PA7.1 U8_PA7.6), power (10 pins)
-5: rectifiers (23 pins), power (C5.2 U4.5)
GND: micro (24 pins), accesory (27 pins), PA_group (8 pins), U_PA_group/PA1 (10 pins), U_PA_group/PA1/L (LED2_U_PA_group_PA1_L.2 LED3_U_PA_group_PA1_L.2), U_PA_group/PA2 (10 pins), U_PA_group/PA2/L (LED2_U_PA_group_PA2_L.2 LED3_U_PA_group_PA2_L.2), U_PA_group/PA3 (10 pins), U_PA_group/PA3/L (LED2_U_PA_group_PA3_L.2 LED3_U_PA_group_PA3_L.2), U_PA_group/PA4 (10 pins), U_PA_group/PA4/L (LED2_U_PA_group_PA4_L.2 LED3_U_PA_group_PA4_L.2), U_PA_group/PA5 (10 pins), U_PA_group/PA5/L (LED2_U_PA_group_PA5_L.2 LED3_U_PA_group_PA5_L.2), U_PA_group/PA6 (10 pins), U_PA_group/PA6/L (LED2_U_PA_group_PA6_L.2 LED3_U_PA_group_PA6_L.2), U_PA_group/PA7 (10 pins), U_PA_group/PA7/L (LED2_U_PA_group_PA7_L.2 LED3_U_PA_group_PA7_L.2), rectifiers (42 pins), power (27 pins)
VPA: PA_group (C48.1 C49.1), U_PA_group/PA1 (5 pins), U_PA_group/PA2 (5 pins), U_PA_group/PA3 (5 pins), U_PA_group/PA4 (5 pins), U_PA_group/PA5 (5 pins), U_PA_group/PA6 (5 pins), U_PA_group/PA7 (5 pins), power (C9.1 L2.2)
ADC1: micro (U1.32), rectifiers (D4.2 R19.1 U13.1)
ADC2: micro (U1.33), rectifiers (D9.2 R29.1 U13.7)
ADC3: micro (U1.34), rectifiers (D11.2 R52.1 U13.8)
ADC4: micro (U1.35), rectifiers (D13.2 R62.1 U13.14)
ADC5: micro (U1.30), rectifiers (D8.2 R21.1 U14.1)
ADC6: micro (U1.31), rectifiers (D10.2 R31.1 U14.7)
ADC7: micro (U1.29), rectifiers (D12.2 R54.1 U14.8)
clk_n1: micro (U1.44), U_PA_group/PA1 (R9_PA1.2 U8_PA1.2)
clk_n2: micro (U1.47), U_PA_group/PA2 (R9_PA2.2 U8_PA2.2)
clk_n3: micro (U1.60), U_PA_group/PA3 (R9_PA3.2 U8_PA3.2)
clk_n4: micro (U1.62), U_PA_group/PA4 (R9_PA4.2 U8_PA4.2)
clk_n5: micro (U1.64), U_PA_group/PA5 (R9_PA5.2 U8_PA5.2)
clk_n6: micro (U1.66), U_PA_group/PA6 (R9_PA6.2 U8_PA6.2)
clk_n7: micro (U1.68), U_PA_group/PA7 (R9_PA7.2 U8_PA7.2)
clk_p1: micro (U1.43), U_PA_group/PA1 (R13_PA1.1 U8_PA1.4)
clk_p2: micro (U1.46), U_PA_group/PA2 (R13_PA2.1 U8_PA2.4)
clk_p3: micro (U1.59), U_PA_group/PA3 (R13_PA3.1 U8_PA3.4)
clk_p4: micro (U1.61), U_PA_group/PA4 (R13_PA4.1 U8_PA4.4)
clk_p5: micro (U1.63), U_PA_group/PA5 (R13_PA5.1 U8_PA5.4)
clk_p6: micro (U1.65), U_PA_group/PA6 (R13_PA6.1 U8_PA6.4)
clk_p7: micro (U1.67), U_PA_group/PA7 (R13_PA7.1 U8_PA7.4)
coilH1: PA_group (P1.1 P1.2), U_PA_group/PA1 (Q2_PA1.5 Q2_PA1.6 Q2_PA1.7 Q2_PA1.8)
coilH2: PA_group (P1.5 P1.6), U_PA_group/PA2 (Q2_PA2.5 Q2_PA2.6 Q2_PA2.7 Q2_PA2.8)
coilH3: PA_group (P1.9 P1.10), U_PA_group/PA3 (Q2_PA3.5 Q2_PA3.6 Q2_PA3.7 Q2_PA3.8)
coilH4: PA_group (P1.13 P1.14), U_PA_group/PA4 (Q2_PA4.5 Q2_PA4.6 Q2_PA4.7 Q2_PA4.8)
coilH5: PA_group (P1.17 P1.18), U_PA_group/PA5 (Q2_PA5.5 Q2_PA5.6 Q2_PA5.7 Q2_PA5.8)
coilH6: PA_group (P1.21 P1.22), U_PA_group/PA6 (Q2_PA6.5 Q2_PA6.6 Q2_PA6.7 Q2_PA6.8)
coilH7: PA_group (P1.25 P1.26), U_PA_group/PA7 (Q2_PA7.5 Q2_PA7.6 Q2_PA7.7 Q2_PA7.8)
coilL1: PA_group (P1.3 P1.4), U_PA_group/PA1 (R14_PA1.2), rectifiers (R22.2)
coilL2: PA_group (P1.7 P1.8), U_PA_group/PA2 (R14_PA2.2), rectifiers (R32.2)
coilL3: PA_group (P1.11 P1.12), U_PA_group/PA3 (R14_PA3.2), rectifiers (R55.2)
coilL4: PA_group (P1.15 P1.16), U_PA_group/PA4 (R14_PA4.2), rectifiers (R63.2)
coilL5: PA_group (P1.19 P1.20), U_PA_group/PA5 (R14_PA5.2), rectifiers (R23.2)
coilL6: PA_group (P1.23 P1.24), U_PA_group/PA6 (R14_PA6.2), rectifiers (R33.2)
coilL7: PA_group (P1.27 P1.28), U_PA_group/PA7 (R14_PA7.2), rectifiers (R56.2)
ESP_RXD0: micro (U1.98), accesory (H4.2 U5.34)
ESP_TXD0: micro (U1.97), accesory (H4.3 U5.35)
G_led1: PA_group (U9.2), U_PA_group/PA1/L (R17_U_PA_group_PA1_L.2)
G_led2: PA_group (U9.15), U_PA_group/PA2/L (R17_U_PA_group_PA2_L.2)
G_led3: PA_group (U10.4), U_PA_group/PA3/L (R17_U_PA_group_PA3_L.2)
G_led4: PA_group (U9.4), U_PA_group/PA4/L (R17_U_PA_group_PA4_L.2)
G_led5: PA_group (U10.2), U_PA_group/PA5/L (R17_U_PA_group_PA5_L.2)
G_led6: PA_group (U10.15), U_PA_group/PA6/L (R17_U_PA_group_PA6_L.2)
G_led7: PA_group (U9.6), U_PA_group/PA7/L (R17_U_PA_group_PA7_L.2)
LED1: micro (U1.40), accesory (R45.1)
LED2: micro (U1.1), accesory (R46.1)
LED_data: micro (U1.80), PA_group (U9.14)
PB1: micro (U1.39), accesory (C43.2 R41.2 S2.1)
PB2: micro (U1.2), accesory (C44.2 R42.2 S3.1)
Pot1: micro (U1.24), accesory (C45.2 R43.3)
Pot2: micro (U1.25), accesory (C46.2 R44.3)
POT_CS: micro (U1.93), power (U7.1)
POT_SCK: micro (U1.89), power (U7.2)
POT_SI: micro (U1.91), power (U7.3)
QUAD_BK1_CS: micro (U1.92), accesory (U20.1)
QUAD_BK1_IO0: micro (U1.85), accesory (U20.5)
QUAD_BK1_IO1: micro (U1.86), accesory (U20.2)
QUAD_BK1_IO2: micro (U1.87), accesory (U20.3)
QUAD_BK1_IO3: micro (U1.88), accesory (U20.7)
QUAD_CLK: micro (U1.36), accesory (U20.6)
R_led1: PA_group (U9.3), U_PA_group/PA1/L (R16_U_PA_group_PA1_L.2)
R_led2: PA_group (U9.1), U_PA_group/PA2/L (R16_U_PA_group_PA2_L.2)
R_led3: PA_group (U10.5), U_PA_group/PA3/L (R16_U_PA_group_PA3_L.2)
R_led4: PA_group (U9.5), U_PA_group/PA4/L (R16_U_PA_group_PA4_L.2)
R_led5: PA_group (U10.3), U_PA_group/PA5/L (R16_U_PA_group_PA5_L.2)
R_led6: PA_group (U10.1), U_PA_group/PA6/L (R16_U_PA_group_PA6_L.2)
R_led7: PA_group (U9.7), U_PA_group/PA7/L (R16_U_PA_group_PA7_L.2)
reg_clk: micro (U1.77), PA_group (U9.11 U10.11)
reg_ON_OFF: micro (U1.90), power (R3.1)
RX1: micro (U1.82), accesory (H1.2)
RX2: micro (U1.52), accesory (H3.2)
serial_clock: micro (U1.78), PA_group (U9.12 U10.12)
TX1: micro (U1.81), accesory (H1.3)
TX2: micro (U1.51), accesory (H3.3)
USB_DM: micro (U1.70), accesory (R48.2)
USB_DP: micro (U1.71), accesory (R49.2)
USB_ID: micro (U1.69), accesory (p3.4)